# EAGLE schematic Botball_v7 (EAGLE 9.5.2), part 2 of 3
## Sheet 25 of 45
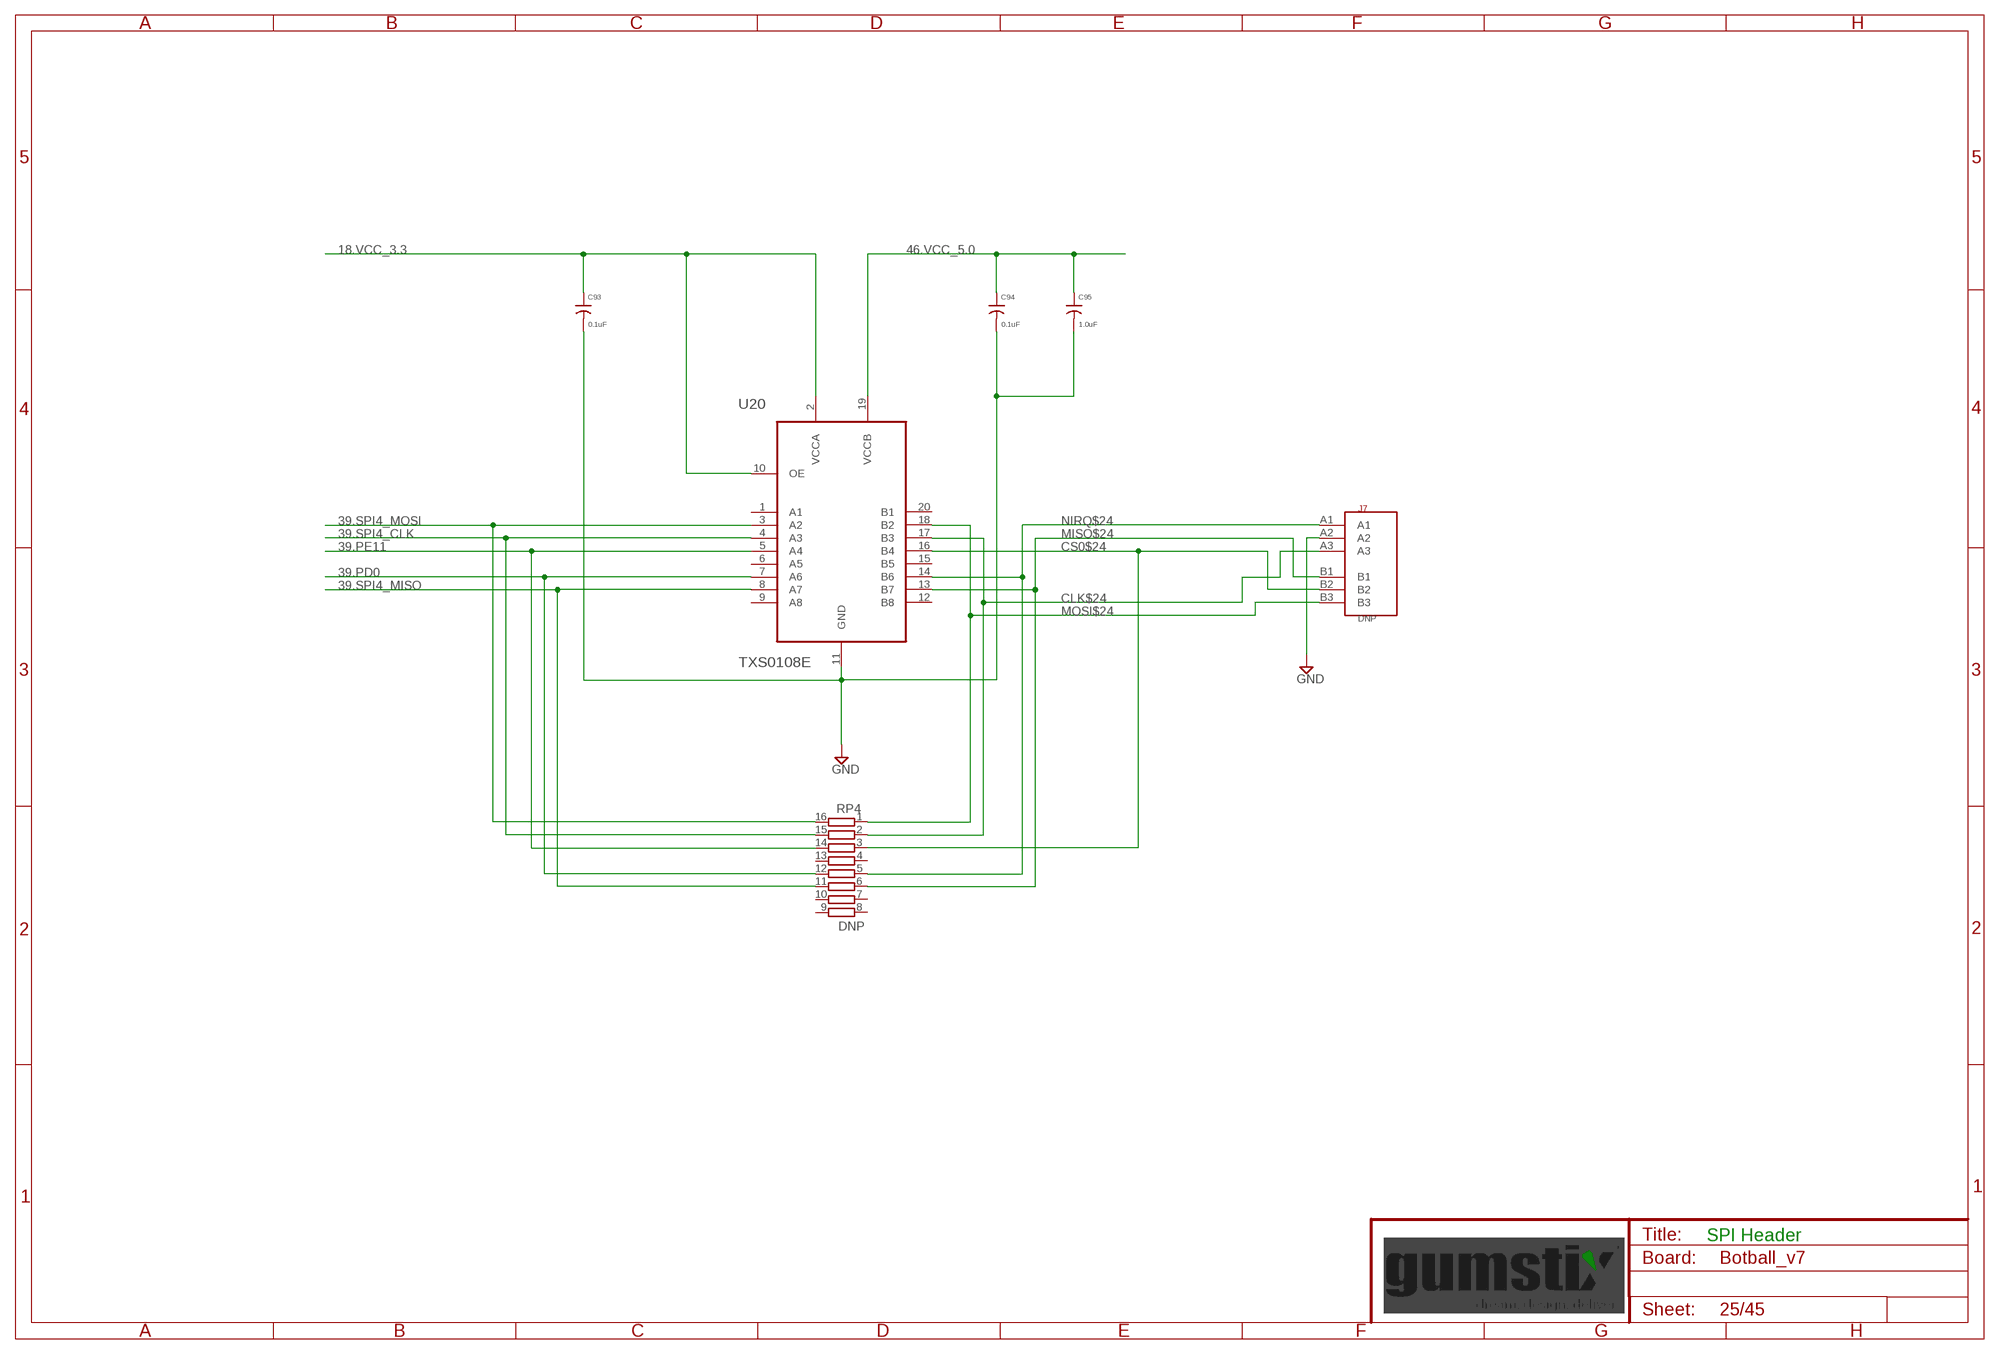
[diagram p24: schematic, sheet 25]

### Parts
C93  0.1uF  C0201  [0201]
C94  0.1uF  C0201  [0201]
C95  1.0uF  C0402  [0402]
J7  DNP  2X03  [2X03]
RP4  DNP  RP741X163  [741X16]
U20  TXS0108E  [QFN20]

### Nets
18.VCC_3.3 [supply]: C93.1 U20.2(VCCA) U20.10(OE) ; also sheet 3,4,7,8,9,11,12,13,14,16,17,18,19,20,21,23,24,26,27,28,29,31,33,34,36,37,38,39
39.PD0: RP4.12 U20.7(A6) ; also sheet 36
39.PE11: RP4.14 U20.5(A4) ; also sheet 36
39.SPI4_CLK: RP4.15 U20.4(A3) ; also sheet 36
39.SPI4_MISO: RP4.11 U20.8(A7) ; also sheet 36
39.SPI4_MOSI: RP4.16 U20.3(A2) ; also sheet 36
46.VCC_5.0 [supply]: C94.1 C95.1 U20.19(VCCB) ; also sheet 2,10,13,15,27,32,39,40,43,45
CLK$24: J7.A3 RP4.2 U20.17(B3)
CS0$24: J7.B2 RP4.3 U20.16(B4)
GND [supply]: C93.2 C94.2 C95.2 J7.A2 U20.11(GND) ; also sheet 2,3,4,5,6,7,9,10,11,12,13,14,15,16,17,18,19,20,21,22,23,24,26,27,28,29,30,31,32,33,34,35,36,37,38,39,40,41,42,43,44,45
MISO$24: J7.B1 RP4.6 U20.13(B7)
MOSI$24: J7.B3 RP4.1 U20.18(B2)
NIRQ$24: J7.A1 RP4.5 U20.14(B6)
Unconnected: RP4.4 RP4.7 RP4.8 RP4.9 RP4.10 RP4.13 U20.1(A1) U20.6(A5) U20.9(A8) U20.12(B8) U20.15(B5) U20.20(B1)

### Notes on the sheet
- SPI Header

## Sheet 26 of 45
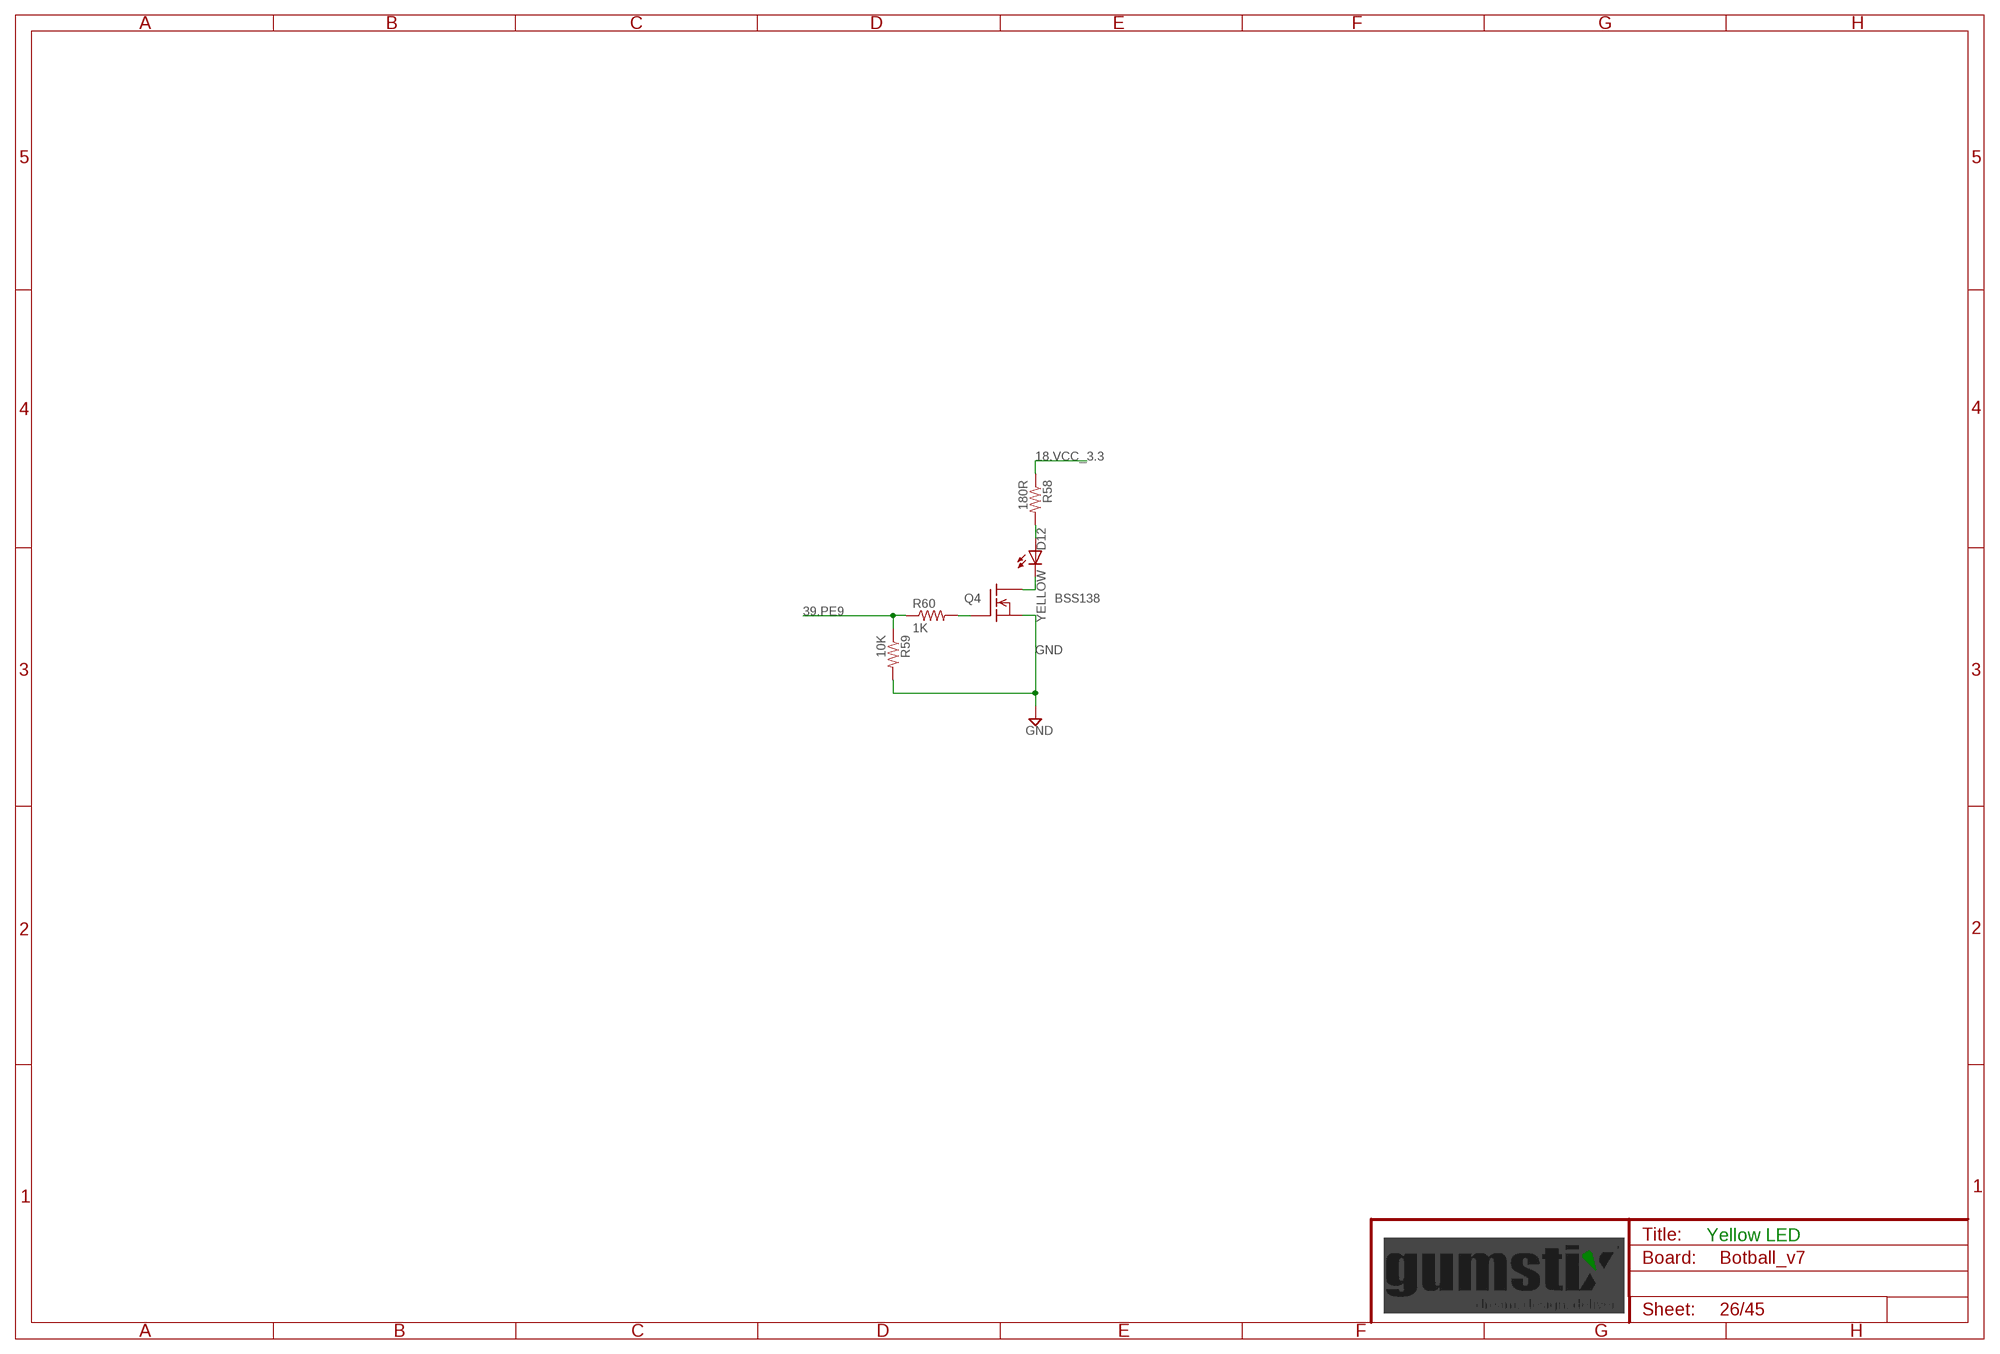
[diagram p25: schematic, sheet 26]

### Parts
D12  YELLOW  LED0603  [D0603]
Q4  BSS138  [SOT23]
R58  180R  R0402  [0402]
R59  10K  R0402  [0402]
R60  1K  R0402  [0402]

### Nets
18.VCC_3.3 [supply]: R58.1 ; also sheet 3,4,7,8,9,11,12,13,14,16,17,18,19,20,21,23,24,25,27,28,29,31,33,34,36,37,38,39
39.PE9: R59.1 R60.1 ; also sheet 36
GND [supply]: Q4.2(S) R59.2 ; also sheet 2,3,4,5,6,7,9,10,11,12,13,14,15,16,17,18,19,20,21,22,23,24,25,27,28,29,30,31,32,33,34,35,36,37,38,39,40,41,42,43,44,45
N1$26: D12.A R58.2
N2$26: D12.C Q4.3(D)
N3$26: Q4.1(G) R60.2

### Notes on the sheet
- Yellow LED

## Sheet 27 of 45
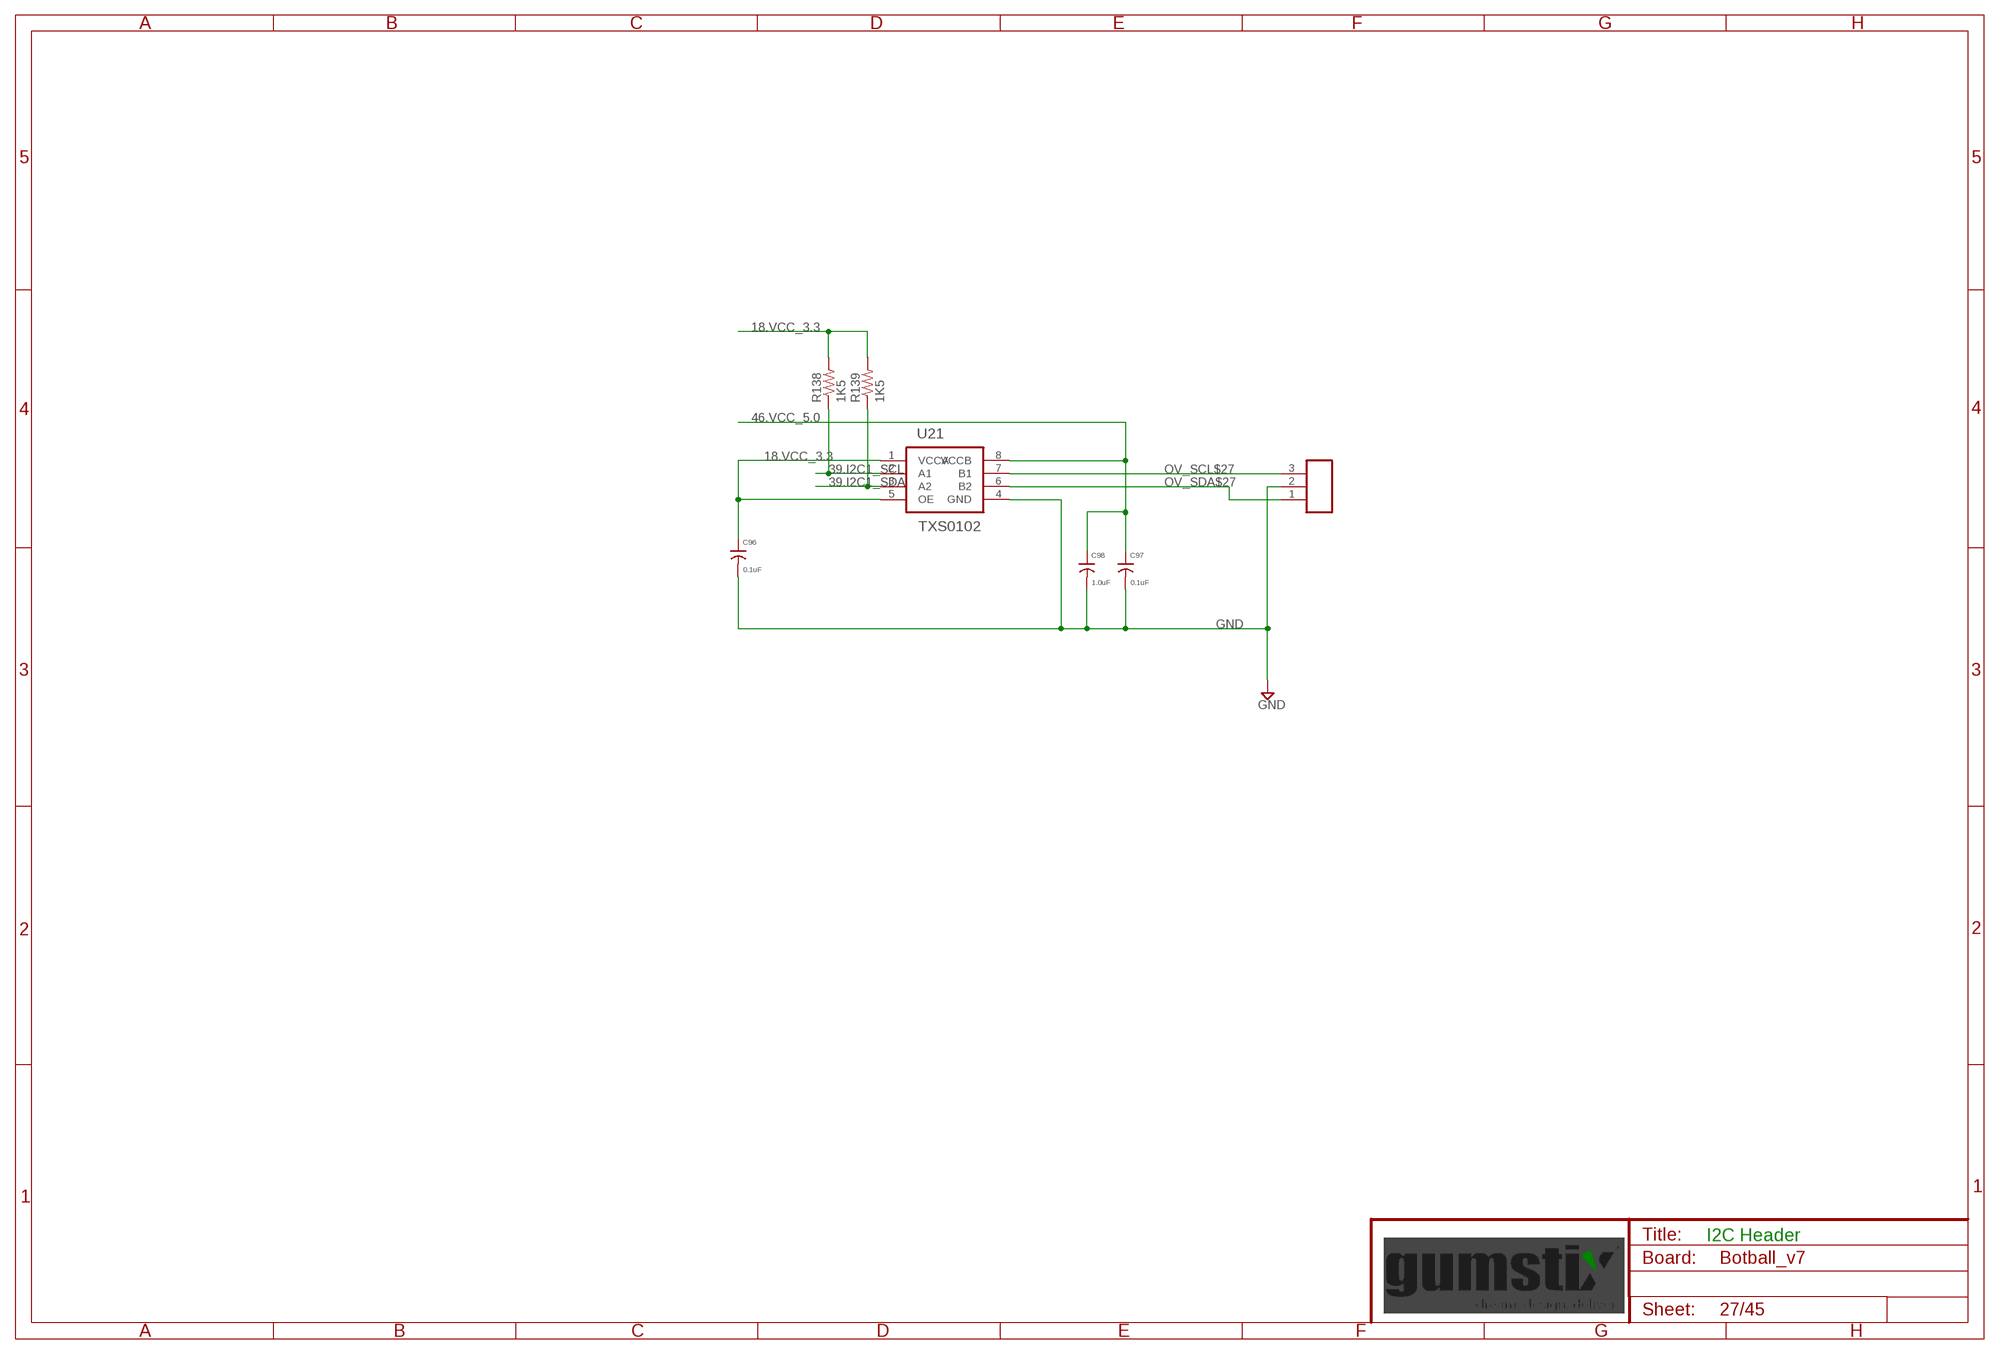
[diagram p26: schematic, sheet 27]

### Parts
C96  0.1uF  C0201  [0201]
C97  0.1uF  C0201  [0201]
C98  1.0uF  C0402  [0402]
J8  DNP  MA03X1100  [MA03-100]
R138  1K5  R0201  [0201]
R139  1K5  R0201  [0201]
U21  TXS0102  [DFN8-0.4P]

### Nets
18.VCC_3.3 [supply]: C96.1 R138.2 R139.2 U21.1(VCCA) U21.5(OE) ; also sheet 3,4,7,8,9,11,12,13,14,16,17,18,19,20,21,23,24,25,26,28,29,31,33,34,36,37,38,39
39.I2C1_SCL: R138.1 U21.2(A1) ; also sheet 36
39.I2C1_SDA: R139.1 U21.3(A2) ; also sheet 36
46.VCC_5.0 [supply]: C97.1 C98.1 U21.8(VCCB) ; also sheet 2,10,13,15,25,32,39,40,43,45
GND [supply]: C96.2 C97.2 C98.2 J8.2 U21.4(GND) ; also sheet 2,3,4,5,6,7,9,10,11,12,13,14,15,16,17,18,19,20,21,22,23,24,25,26,28,29,30,31,32,33,34,35,36,37,38,39,40,41,42,43,44,45
OV_SCL$27: J8.3 U21.7(B1)
OV_SDA$27: J8.1 U21.6(B2)

### Notes on the sheet
- I2C Header

## Sheet 28 of 45
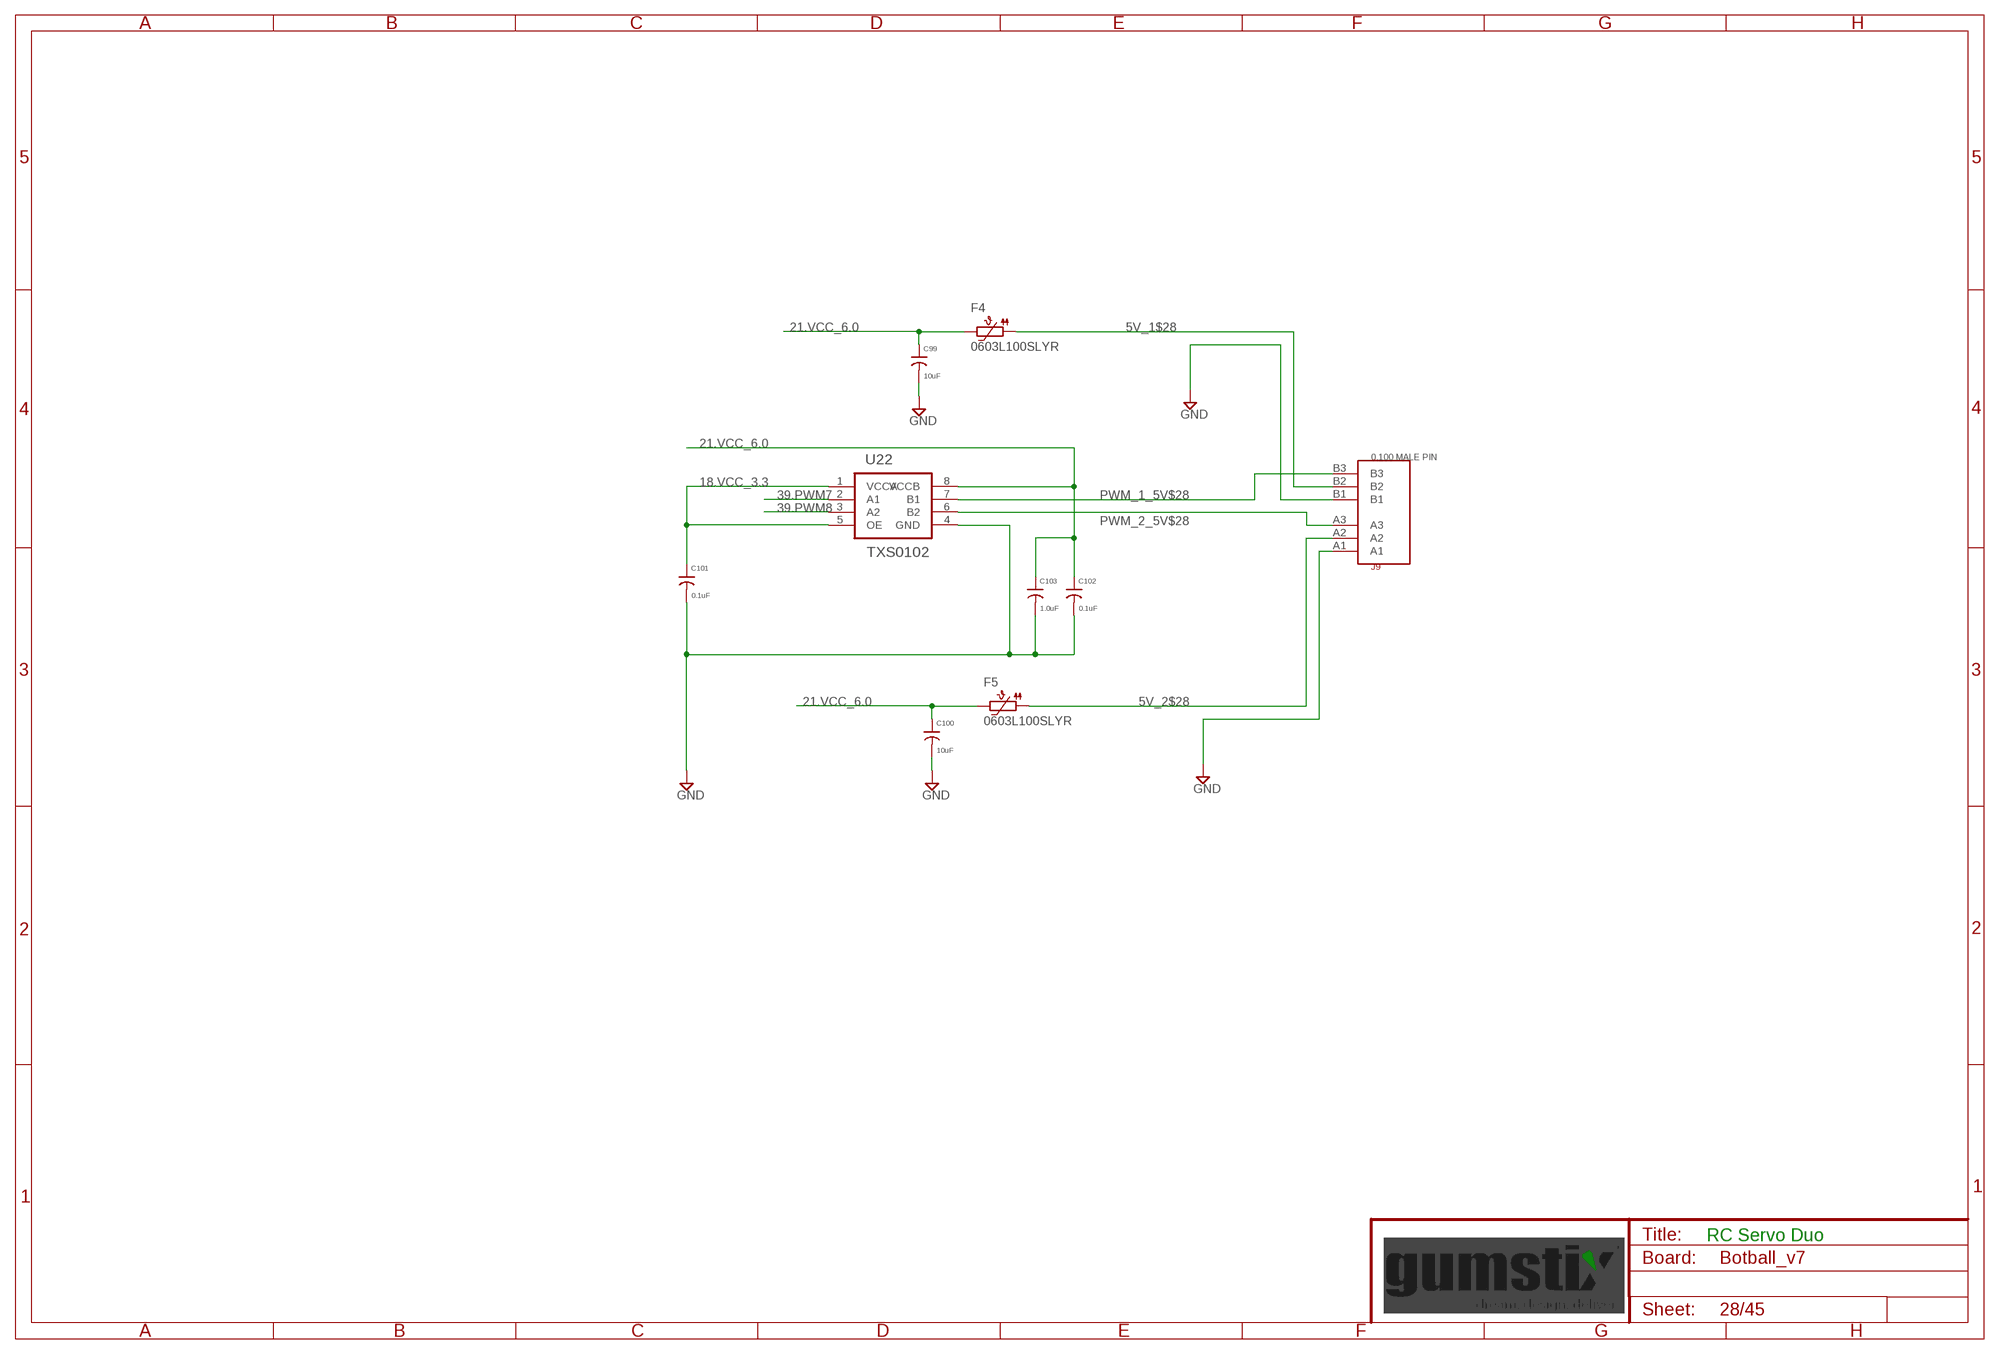
[diagram p27: schematic, sheet 28]

### Parts
C99  10uF  C0402  [0402]
C100  10uF  C0402  [0402]
C101  0.1uF  C0201  [0201]
C102  0.1uF  C0201  [0201]
C103  1.0uF  C0402  [0402]
F4  0603L100SLYR  PTC0603  [0603]
F5  0603L100SLYR  PTC0603  [0603]
J9  0.100 MALE PIN  2X03SHROUD  [2X03_SHROUD]
U22  TXS0102  [DFN8-0.4P]

### Nets
5V_1$28 [supply]: F4.1 J9.B2
5V_2$28 [supply]: F5.1 J9.A2
18.VCC_3.3 [supply]: C101.1 U22.1(VCCA) U22.5(OE) ; also sheet 3,4,7,8,9,11,12,13,14,16,17,18,19,20,21,23,24,25,26,27,29,31,33,34,36,37,38,39
21.VCC_6.0 [supply]: C99.1 C100.1 C102.1 C103.1 F4.2 F5.2 U22.8(VCCB) ; also sheet 3,22
39.PWM7: U22.2(A1) ; also sheet 36
39.PWM8: U22.3(A2) ; also sheet 36
GND [supply]: C99.2 C100.2 C101.2 C102.2 C103.2 J9.A1 J9.B1 U22.4(GND) ; also sheet 2,3,4,5,6,7,9,10,11,12,13,14,15,16,17,18,19,20,21,22,23,24,25,26,27,29,30,31,32,33,34,35,36,37,38,39,40,41,42,43,44,45
PWM_1_5V$28: J9.B3 U22.7(B1)
PWM_2_5V$28: J9.A3 U22.6(B2)

### Notes on the sheet
- RC Servo Duo

## Sheet 29 of 45
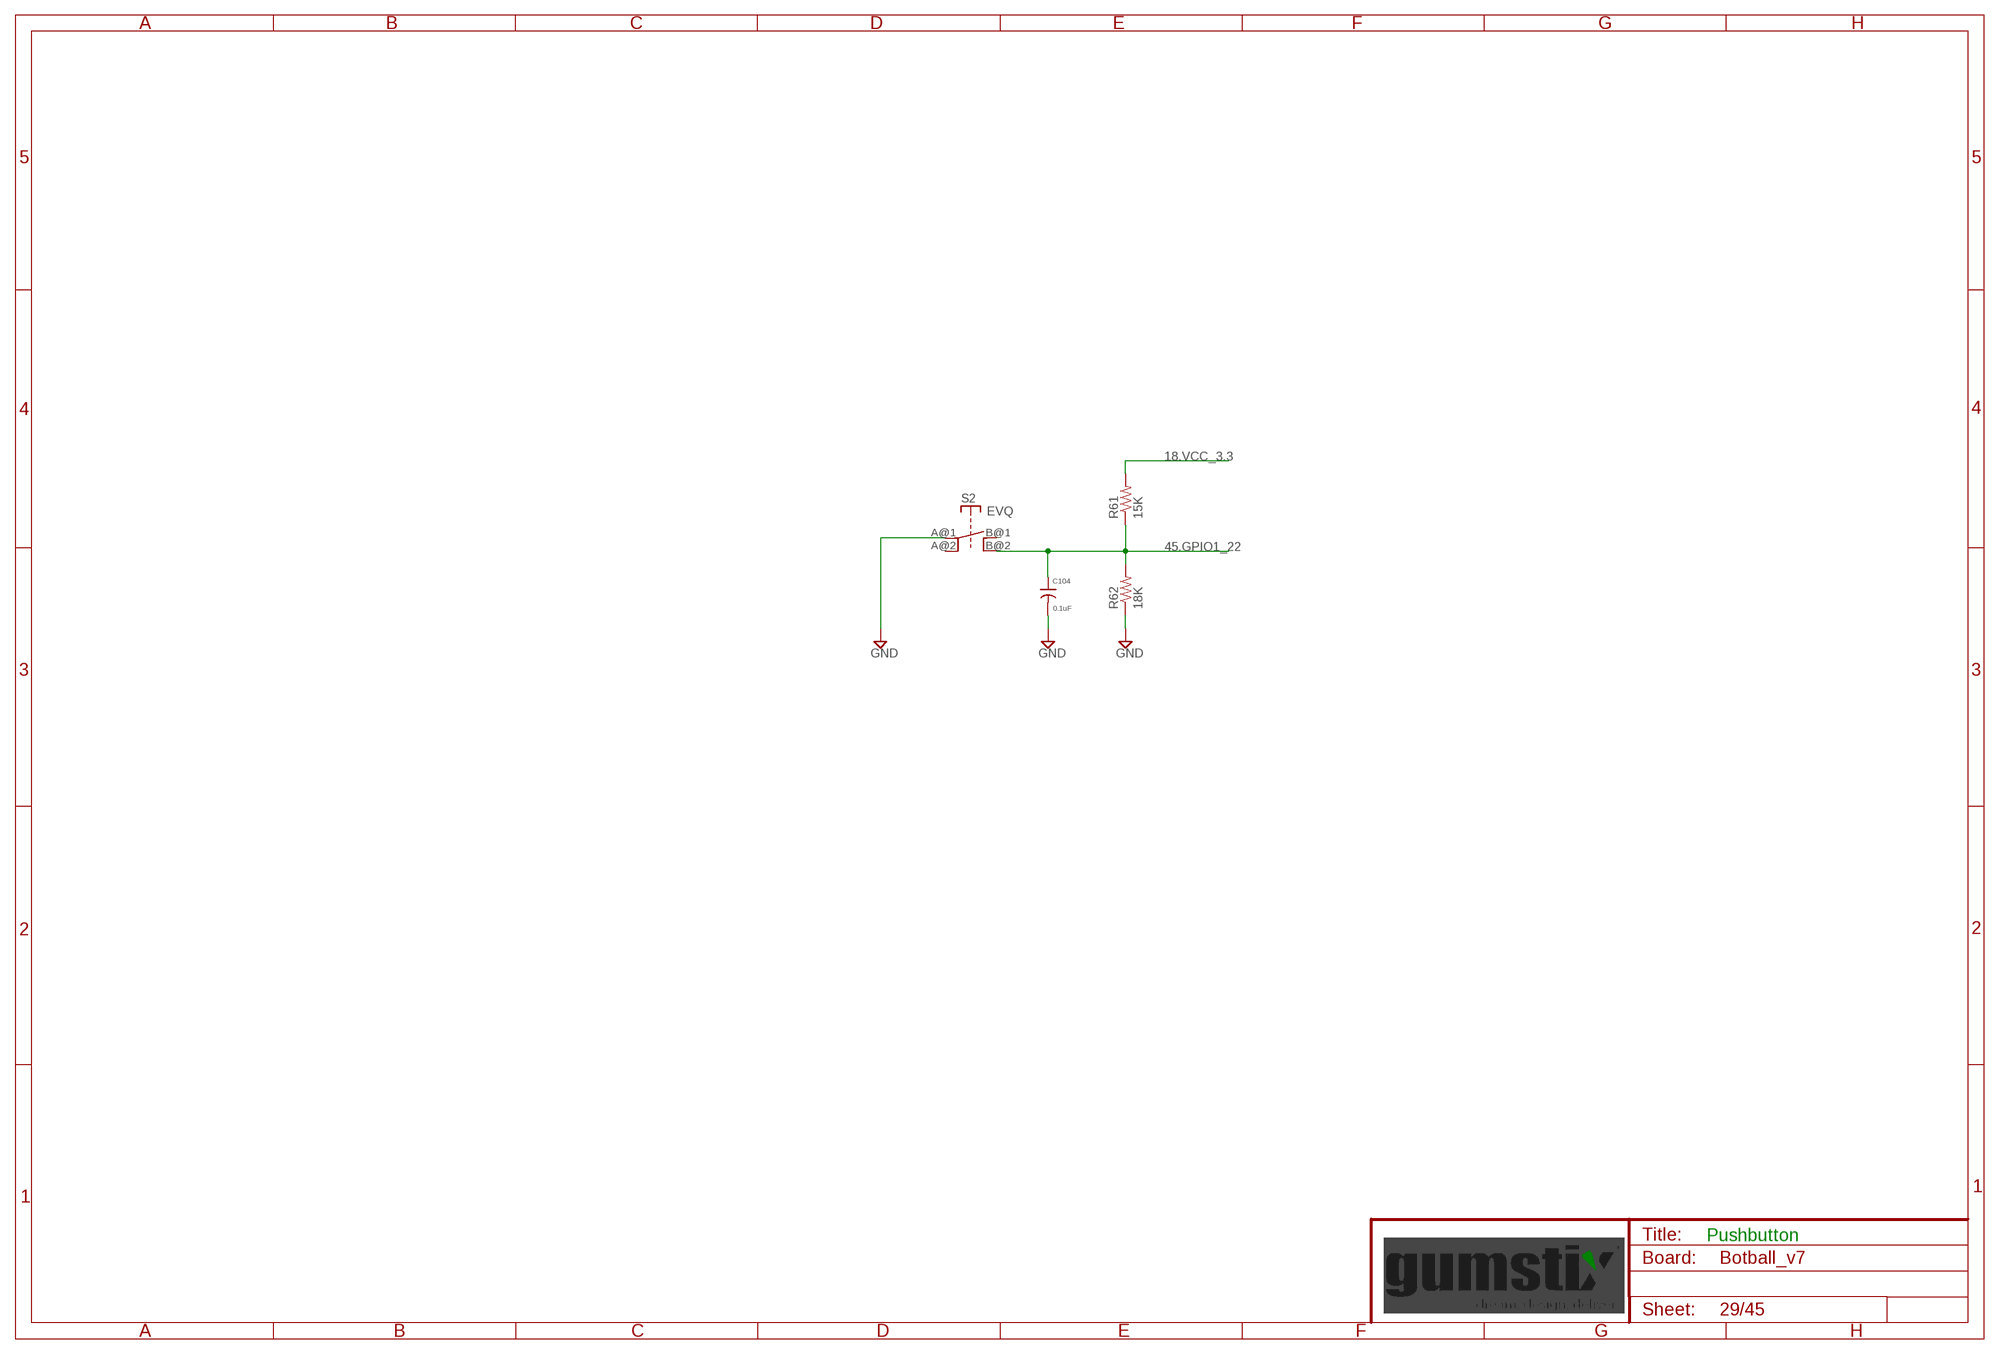
[diagram p28: schematic, sheet 29]

### Parts
C104  0.1uF  C0402  [0402]
R61  15K  R0402  [0402]
R62  18K  R0402  [0402]
S2  EVQ  [EVQ]

### Nets
18.VCC_3.3 [supply]: R61.2 ; also sheet 3,4,7,8,9,11,12,13,14,16,17,18,19,20,21,23,24,25,26,27,28,31,33,34,36,37,38,39
45.GPIO1_22: C104.1 R61.1 R62.2 S2.B@2(B') ; also sheet 42
GND [supply]: C104.2 R62.1 S2.A@1(A) ; also sheet 2,3,4,5,6,7,9,10,11,12,13,14,15,16,17,18,19,20,21,22,23,24,25,26,27,28,30,31,32,33,34,35,36,37,38,39,40,41,42,43,44,45
Unconnected: S2.A@2(A') S2.B@1(B)

### Notes on the sheet
- Pushbutton

## Sheet 30 of 45
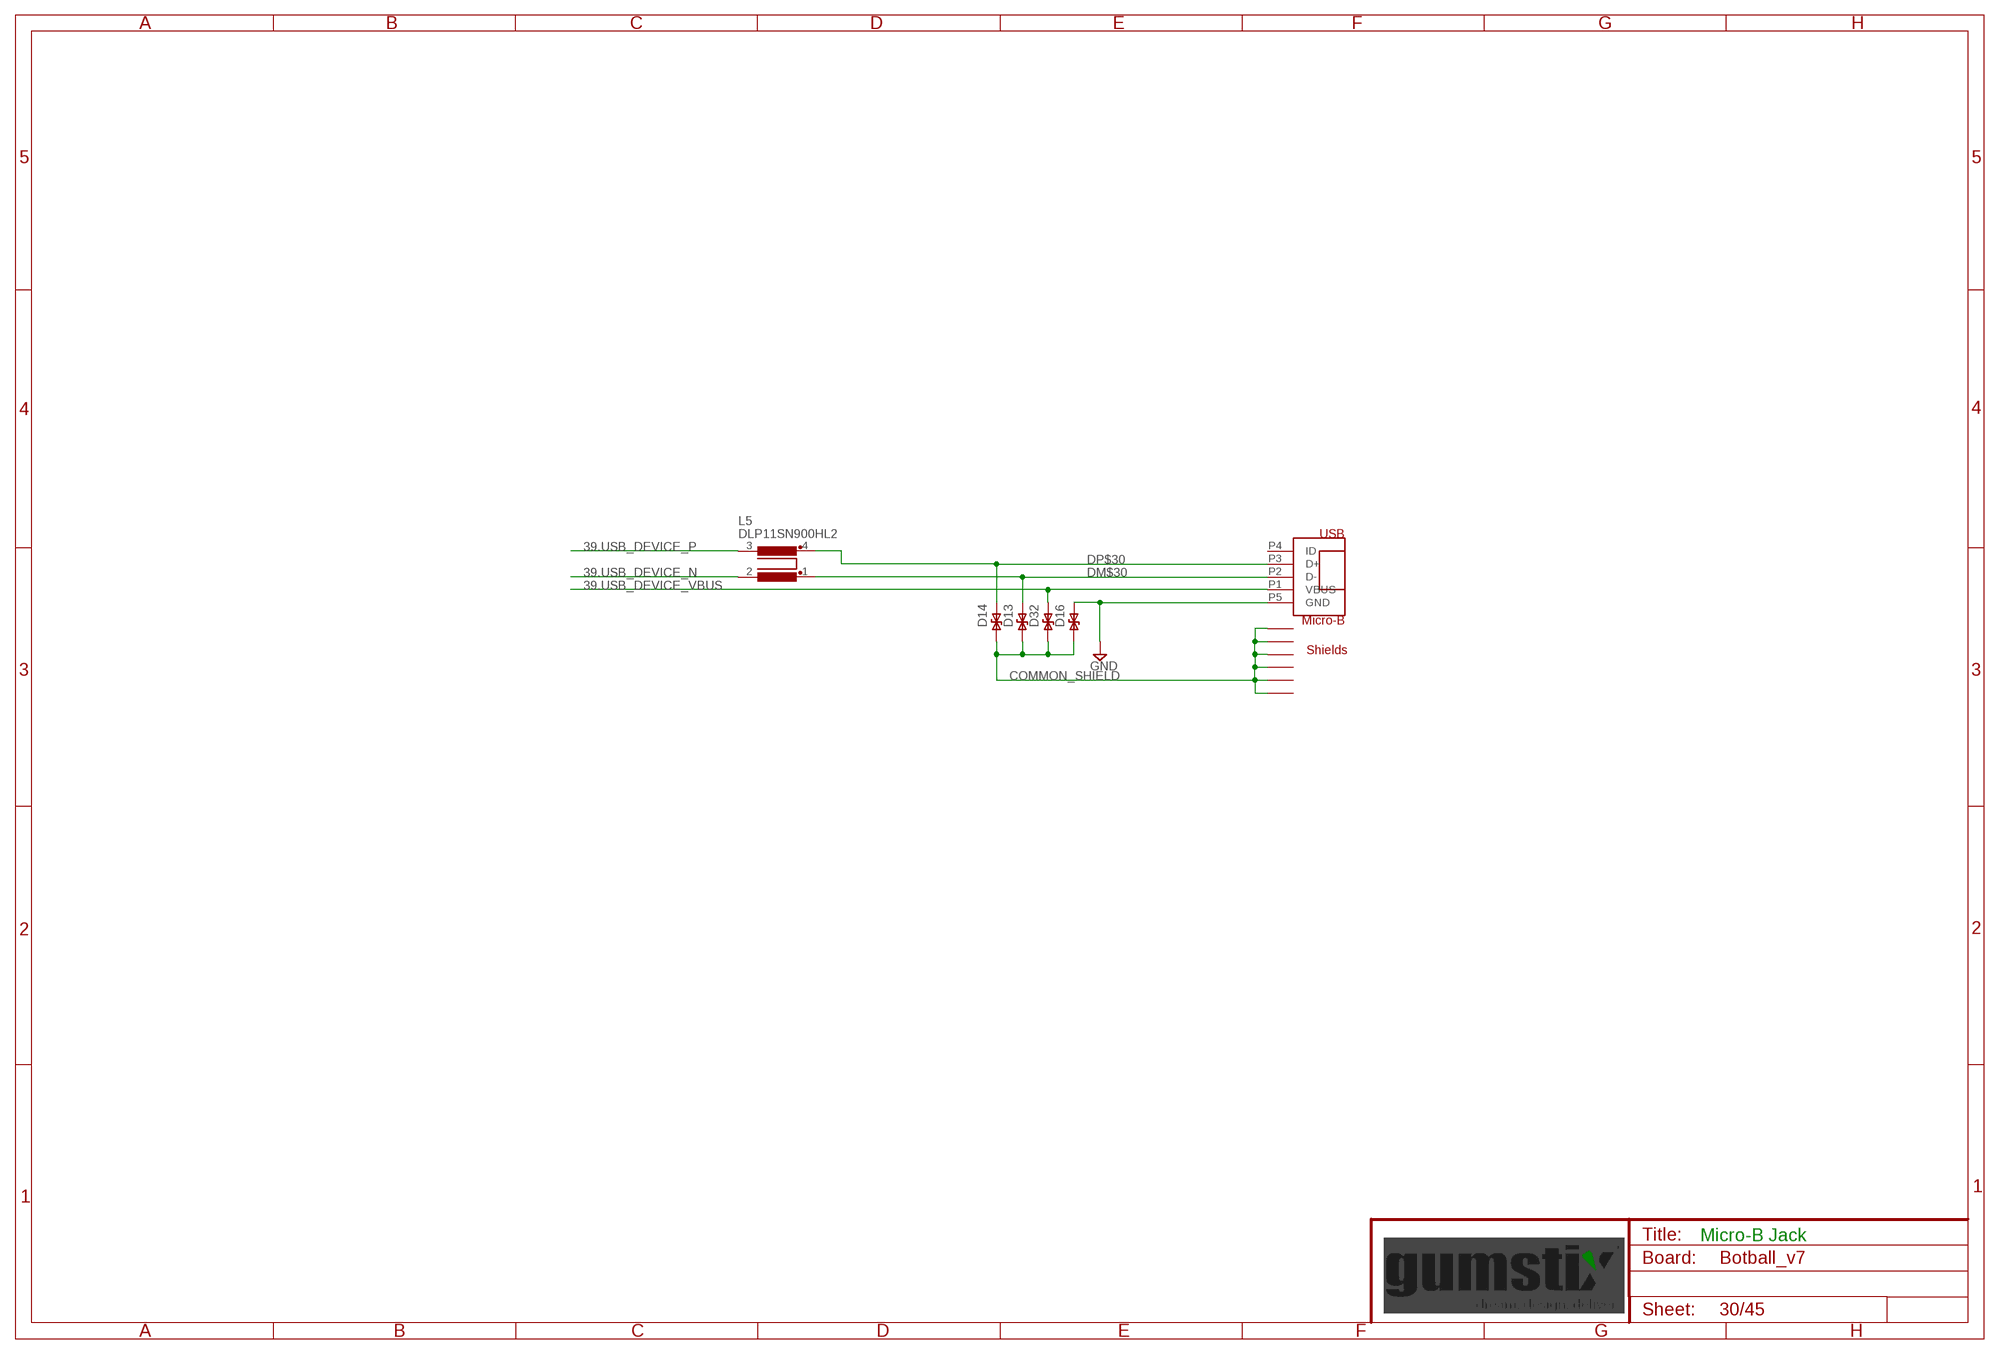
[diagram p29: schematic, sheet 30]

### Parts
D13  PS04LTVA1  ESD-DIODE  [D0402]
D14  PS04LTVA1  ESD-DIODE  [D0402]
D16  B72590D50A060  ESD-DIODE  [D0402]
D32  PS04LTVA1  ESD-DIODE  [D0402]
J10  USB_MICRO_B  [USB_MICRO_B]
L5  DLP11SN900HL2  COM_MODE_CHOKE  [0504-DLP11S]

### Nets
39.USB_DEVICE_N [USB]: L5.2 ; also sheet 36
39.USB_DEVICE_P [USB]: L5.3 ; also sheet 36
39.USB_DEVICE_VBUS [supply]: D32.P2 J10.P1(VBUS) ; also sheet 36
COMMON_SHIELD [supply]: D13.P1 D14.P1 D16.P1 D32.P1 J10.COMMON_SHEILD1(COMMON_SHIELD1) J10.COMMON_SHEILD2(COMMON_SHIELD2) J10.COMMON_SHEILD3(COMMON_SHIELD3) J10.COMMON_SHEILD4(COMMON_SHIELD4) J10.COMMON_SHEILD5(COMMON_SHIELD5) J10.COMMON_SHEILD6(COMMON_SHIELD6) ; also sheet 15,35,39
DM$30 [USB]: D13.P2 J10.P2(D-) L5.1
DP$30 [USB]: D14.P2 J10.P3(D+) L5.4
GND [supply]: D16.P2 J10.P5(GND) ; also sheet 2,3,4,5,6,7,9,10,11,12,13,14,15,16,17,18,19,20,21,22,23,24,25,26,27,28,29,31,32,33,34,35,36,37,38,39,40,41,42,43,44,45
Unconnected: J10.P4(ID)

### Notes on the sheet
- Micro-B Jack

## Sheet 31 of 45
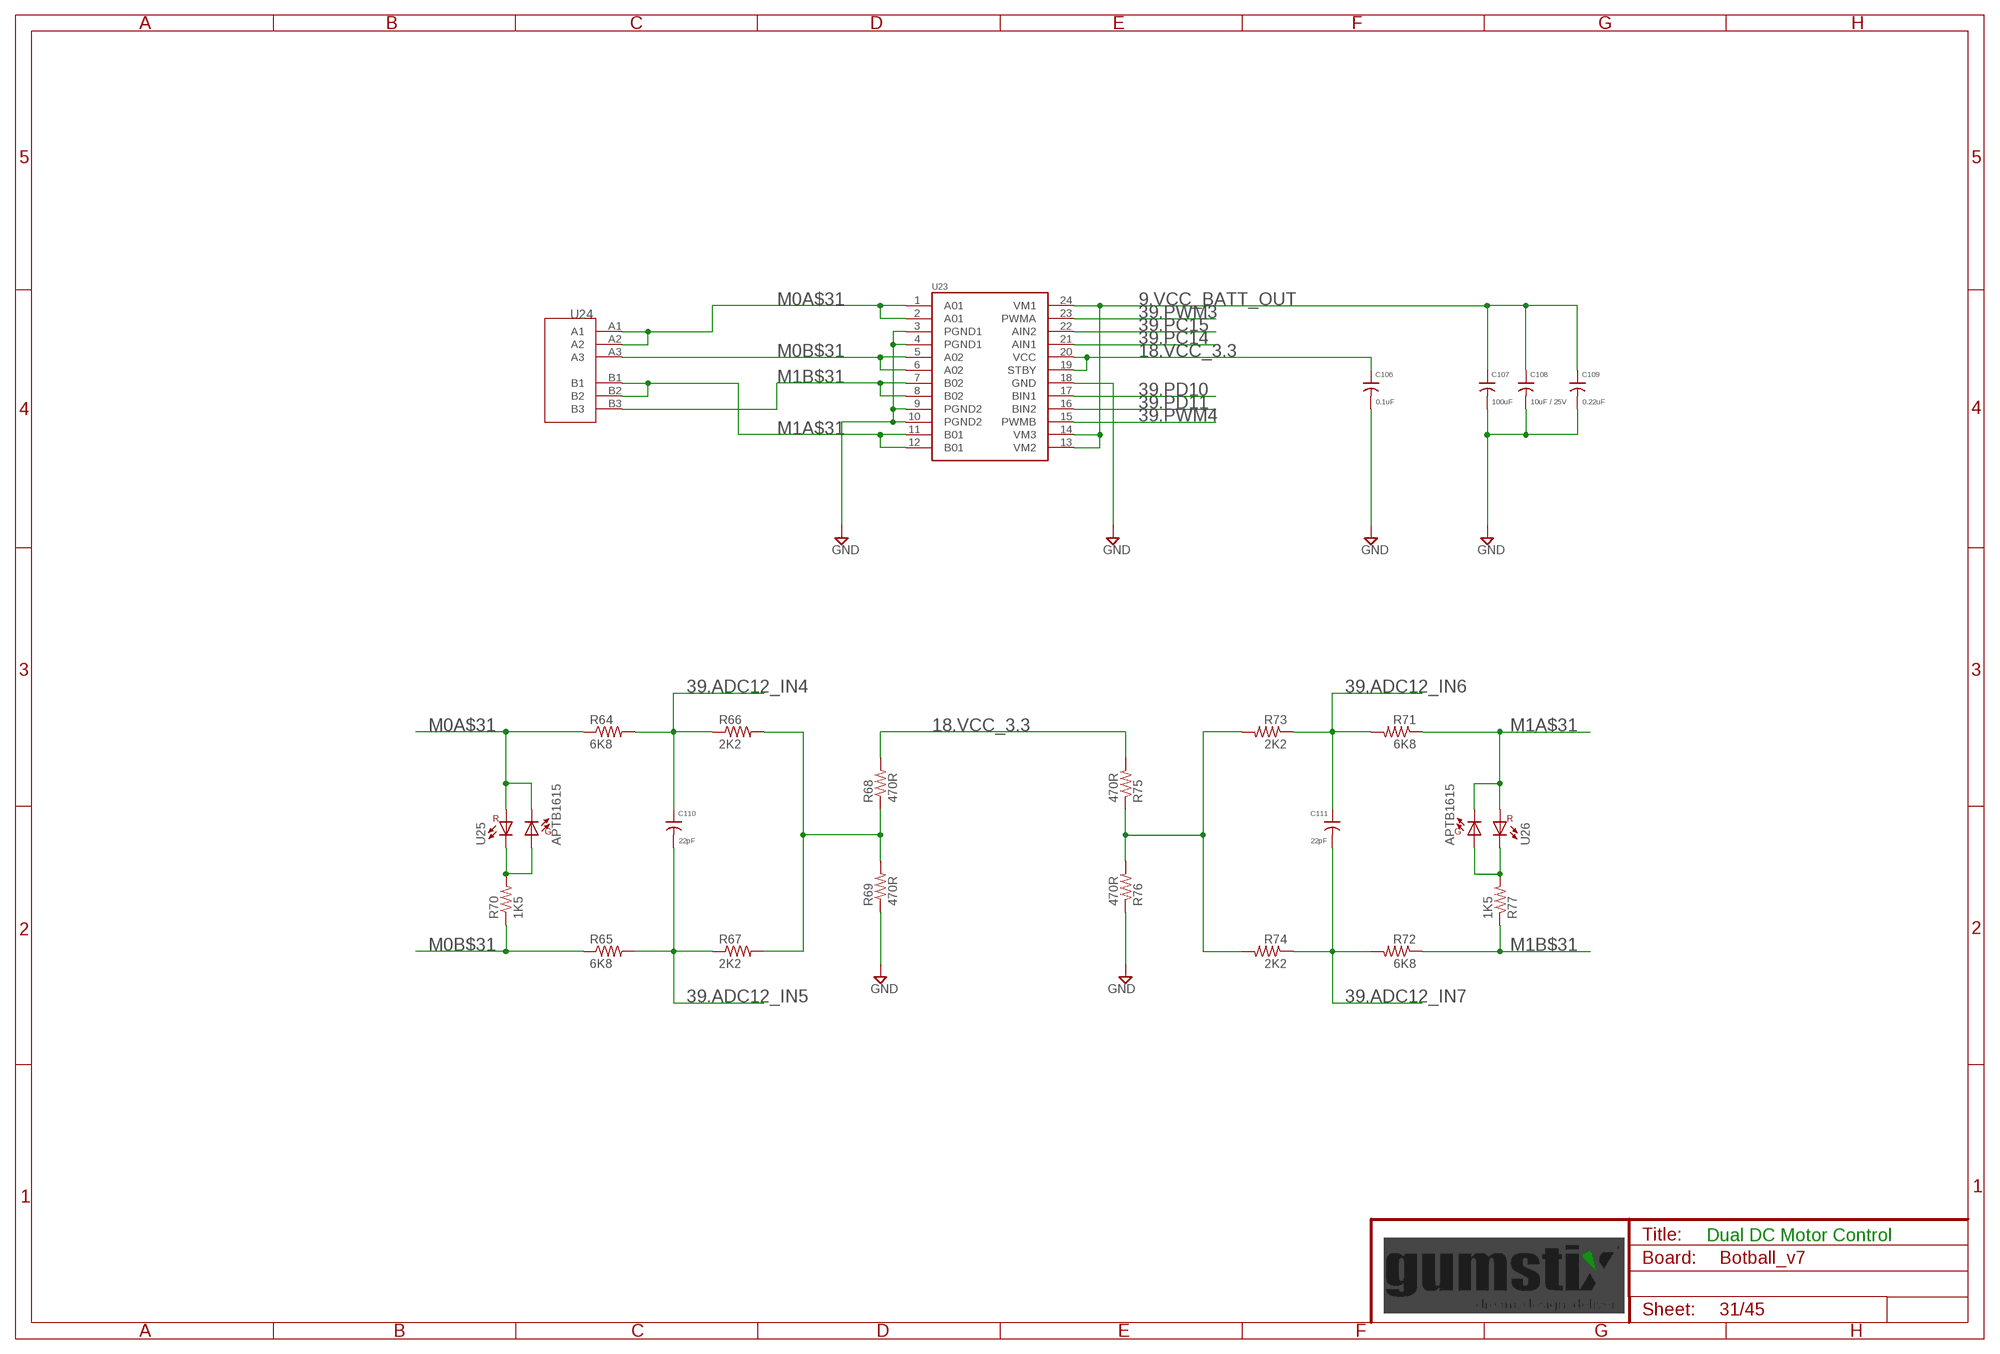
[diagram p30: schematic, sheet 31]

### Parts
C106  0.1uF  C0201  [0201]
C107  100uF  CPANASONIC_D  [PANASONIC_D]
C108  10uF / 25V  C1206  [1206]
C109  0.22uF  C0603  [0603]
C110  22pF  C0402  [0402]
C111  22pF  C0402  [0402]
R64  6K8  R0402  [0402]
R65  6K8  R0402  [0402]
R66  2K2  R0402  [0402]
R67  2K2  R0402  [0402]
R68  470R  R0402  [0402]
R69  470R  R0402  [0402]
R70  1K5  R0402  [0402]
R71  6K8  R0402  [0402]
R72  6K8  R0402  [0402]
R73  2K2  R0402  [0402]
R74  2K2  R0402  [0402]
R75  470R  R0402  [0402]
R76  470R  R0402  [0402]
R77  1K5  R0402  [0402]
U23  TB6612FNG  [SSOP24]
U24  MA03X2 FEMALE  MA03X2  [MA03-2]
U25  APTB1615  [APTB1615]
U26  APTB1615  [APTB1615]

### Nets
9.VCC_BATT_OUT [supply]: C107.+ C108.1 C109.1 U23.13(VM2) U23.14(VM3) U23.24(VM1) ; also sheet 7,10
18.VCC_3.3 [supply]: C106.1 R68.2 R75.2 U23.19(STBY) U23.20(VCC) ; also sheet 3,4,7,8,9,11,12,13,14,16,17,18,19,20,21,23,24,25,26,27,28,29,33,34,36,37,38,39
39.ADC12_IN4: C110.1 R64.2 R66.1 ; also sheet 36
39.ADC12_IN5: C110.2 R65.2 R67.1 ; also sheet 36
39.ADC12_IN6: C111.1 R71.2 R73.1 ; also sheet 36
39.ADC12_IN7: C111.2 R72.2 R74.1 ; also sheet 36
39.PC14: U23.21(AIN1) ; also sheet 36
39.PC15: U23.22(AIN2) ; also sheet 36
39.PD10: U23.17(BIN1) ; also sheet 36
39.PD11: U23.16(BIN2) ; also sheet 36
39.PWM3: U23.23(PWMA) ; also sheet 36
39.PWM4: U23.15(PWMB) ; also sheet 36
D0_OUT$31: R70.2 U25.2 U25.3
D1_OUT$31: R77.2 U26.2 U26.3
GND [supply]: C106.2 C107.- C108.2 C109.2 R69.1 R76.1 U23.3(PGND1) U23.4(PGND1) U23.9(PGND2) U23.10(PGND2) U23.18(GND) ; also sheet 2,3,4,5,6,7,9,10,11,12,13,14,15,16,17,18,19,20,21,22,23,24,25,26,27,28,29,30,32,33,34,35,36,37,38,39,40,41,42,43,44,45
M0A$31 [supply]: R64.1 U23.1(A01) U23.2(A01) U24.A1 U24.A2 U25.1 U25.4
M0B$31: R65.1 R70.1 U23.5(A02) U23.6(A02) U24.A3
M1A$31 [supply]: R71.1 U23.11(B01) U23.12(B01) U24.B1 U24.B2 U26.1 U26.4
M1B$31 [supply]: R72.1 R77.1 U23.7(B02) U23.8(B02) U24.B3
VD0$31: R66.2 R67.2 R68.1 R69.2
VD1$31: R73.2 R74.2 R75.1 R76.2

### Notes on the sheet
- Dual DC Motor Control

## Sheet 32 of 45
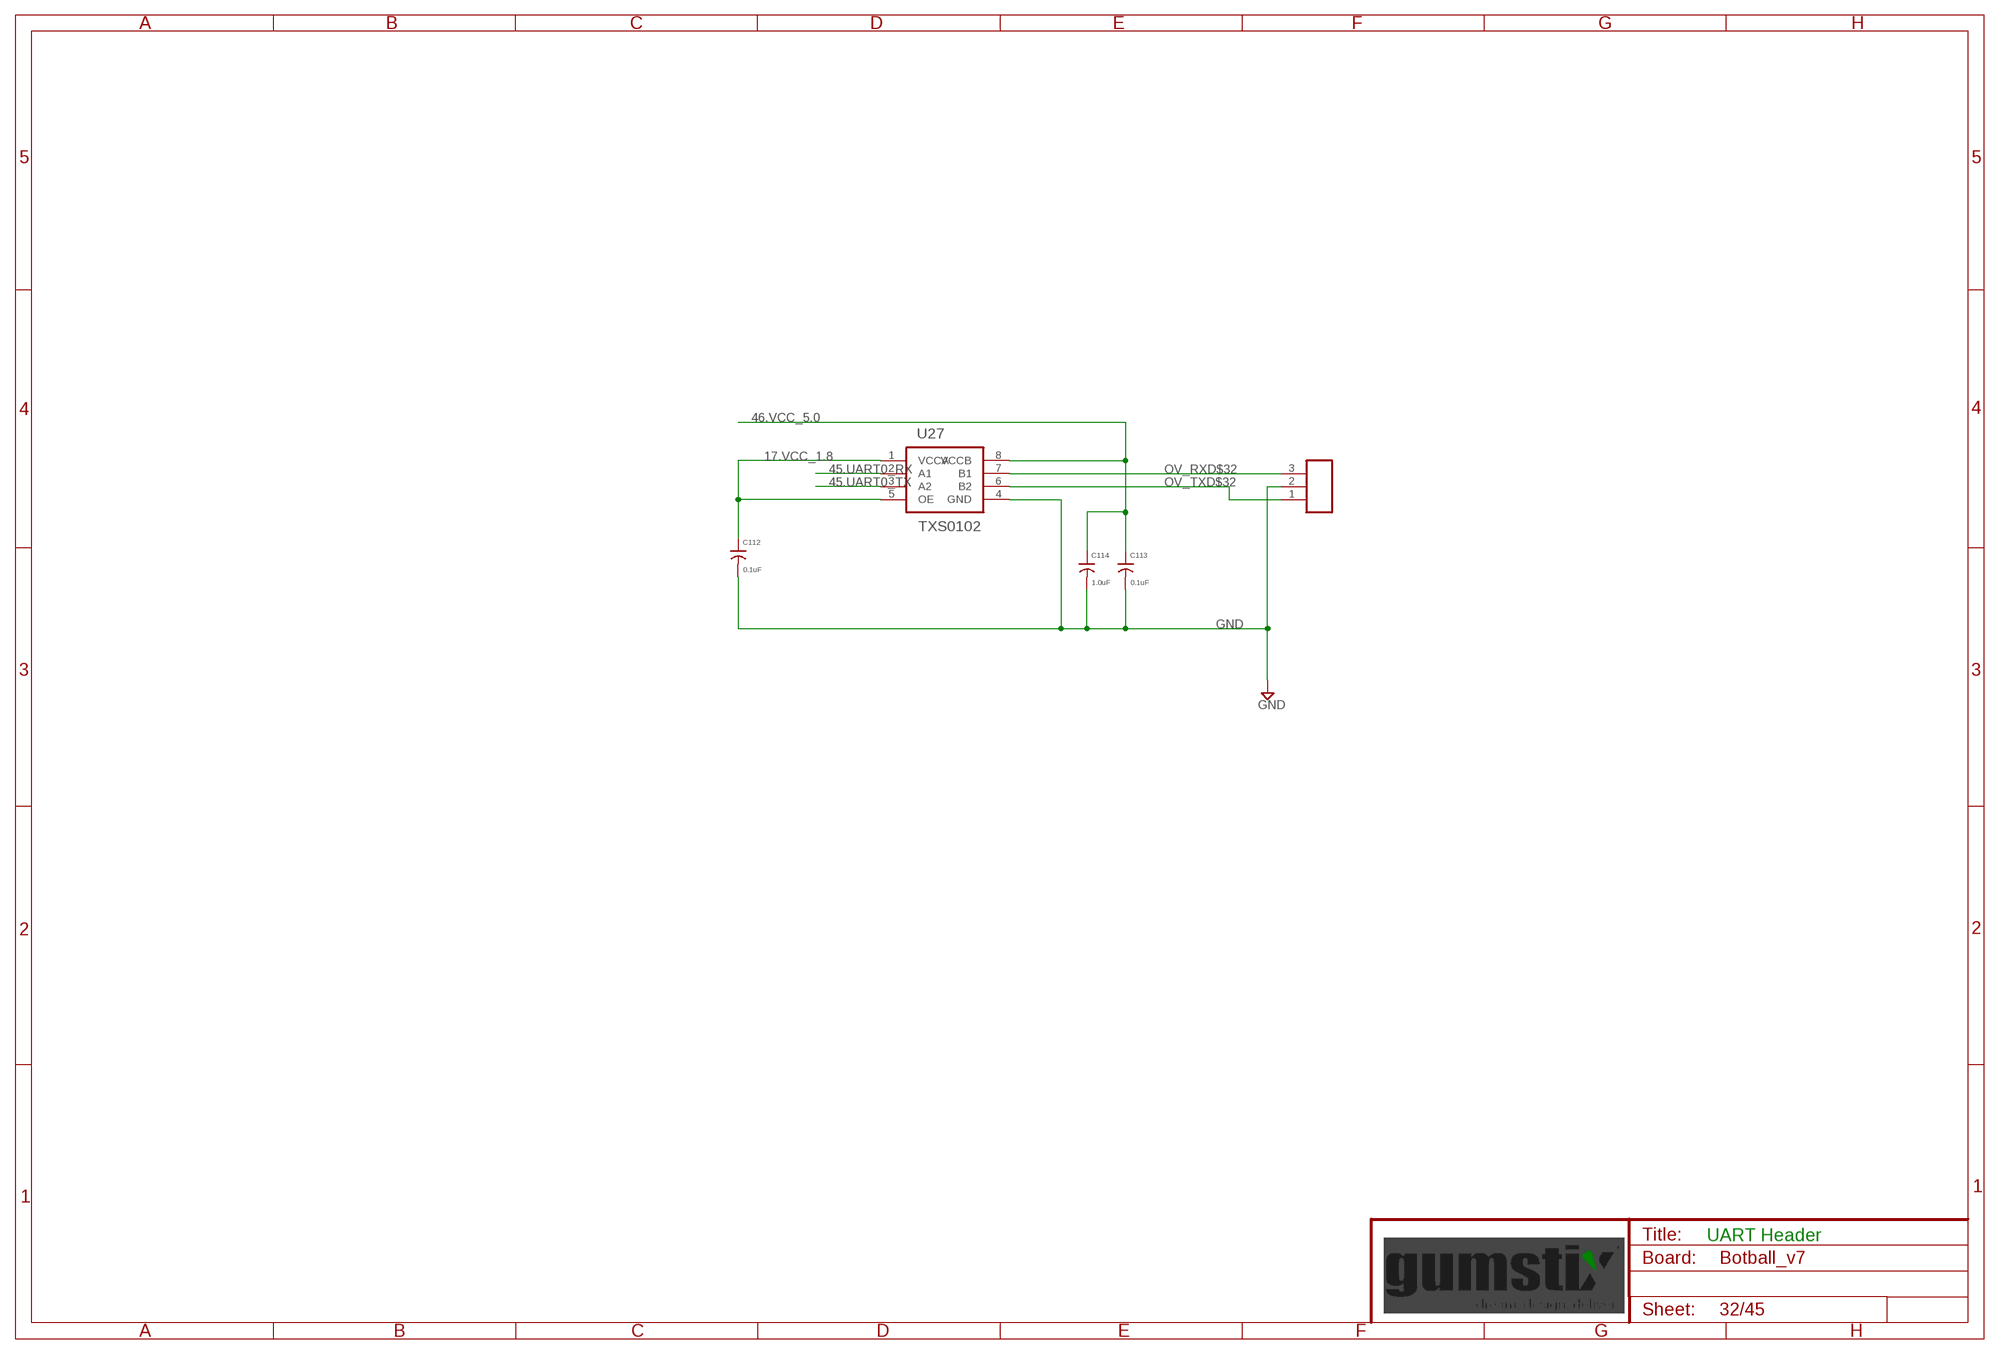
[diagram p31: schematic, sheet 32]

### Parts
C112  0.1uF  C0201  [0201]
C113  0.1uF  C0201  [0201]
C114  1.0uF  C0402  [0402]
J11  MA03X1 MALE  MA03X1100  [MA03-100]
U27  TXS0102  [DFN8-0.4P]

### Nets
17.VCC_1.8 [supply]: C112.1 U27.1(VCCA) U27.5(OE) ; also sheet 2,6,9,11,16,17,18,33,37,38,39
45.UART0_RX: U27.2(A1) ; also sheet 43
45.UART0_TX: U27.3(A2) ; also sheet 43
46.VCC_5.0 [supply]: C113.1 C114.1 U27.8(VCCB) ; also sheet 2,10,13,15,25,27,39,40,43,45
GND [supply]: C112.2 C113.2 C114.2 J11.2 U27.4(GND) ; also sheet 2,3,4,5,6,7,9,10,11,12,13,14,15,16,17,18,19,20,21,22,23,24,25,26,27,28,29,30,31,33,34,35,36,37,38,39,40,41,42,43,44,45
OV_RXD$32: J11.3 U27.7(B1)
OV_TXD$32: J11.1 U27.6(B2)

### Notes on the sheet
- UART Header

## Sheet 33 of 45
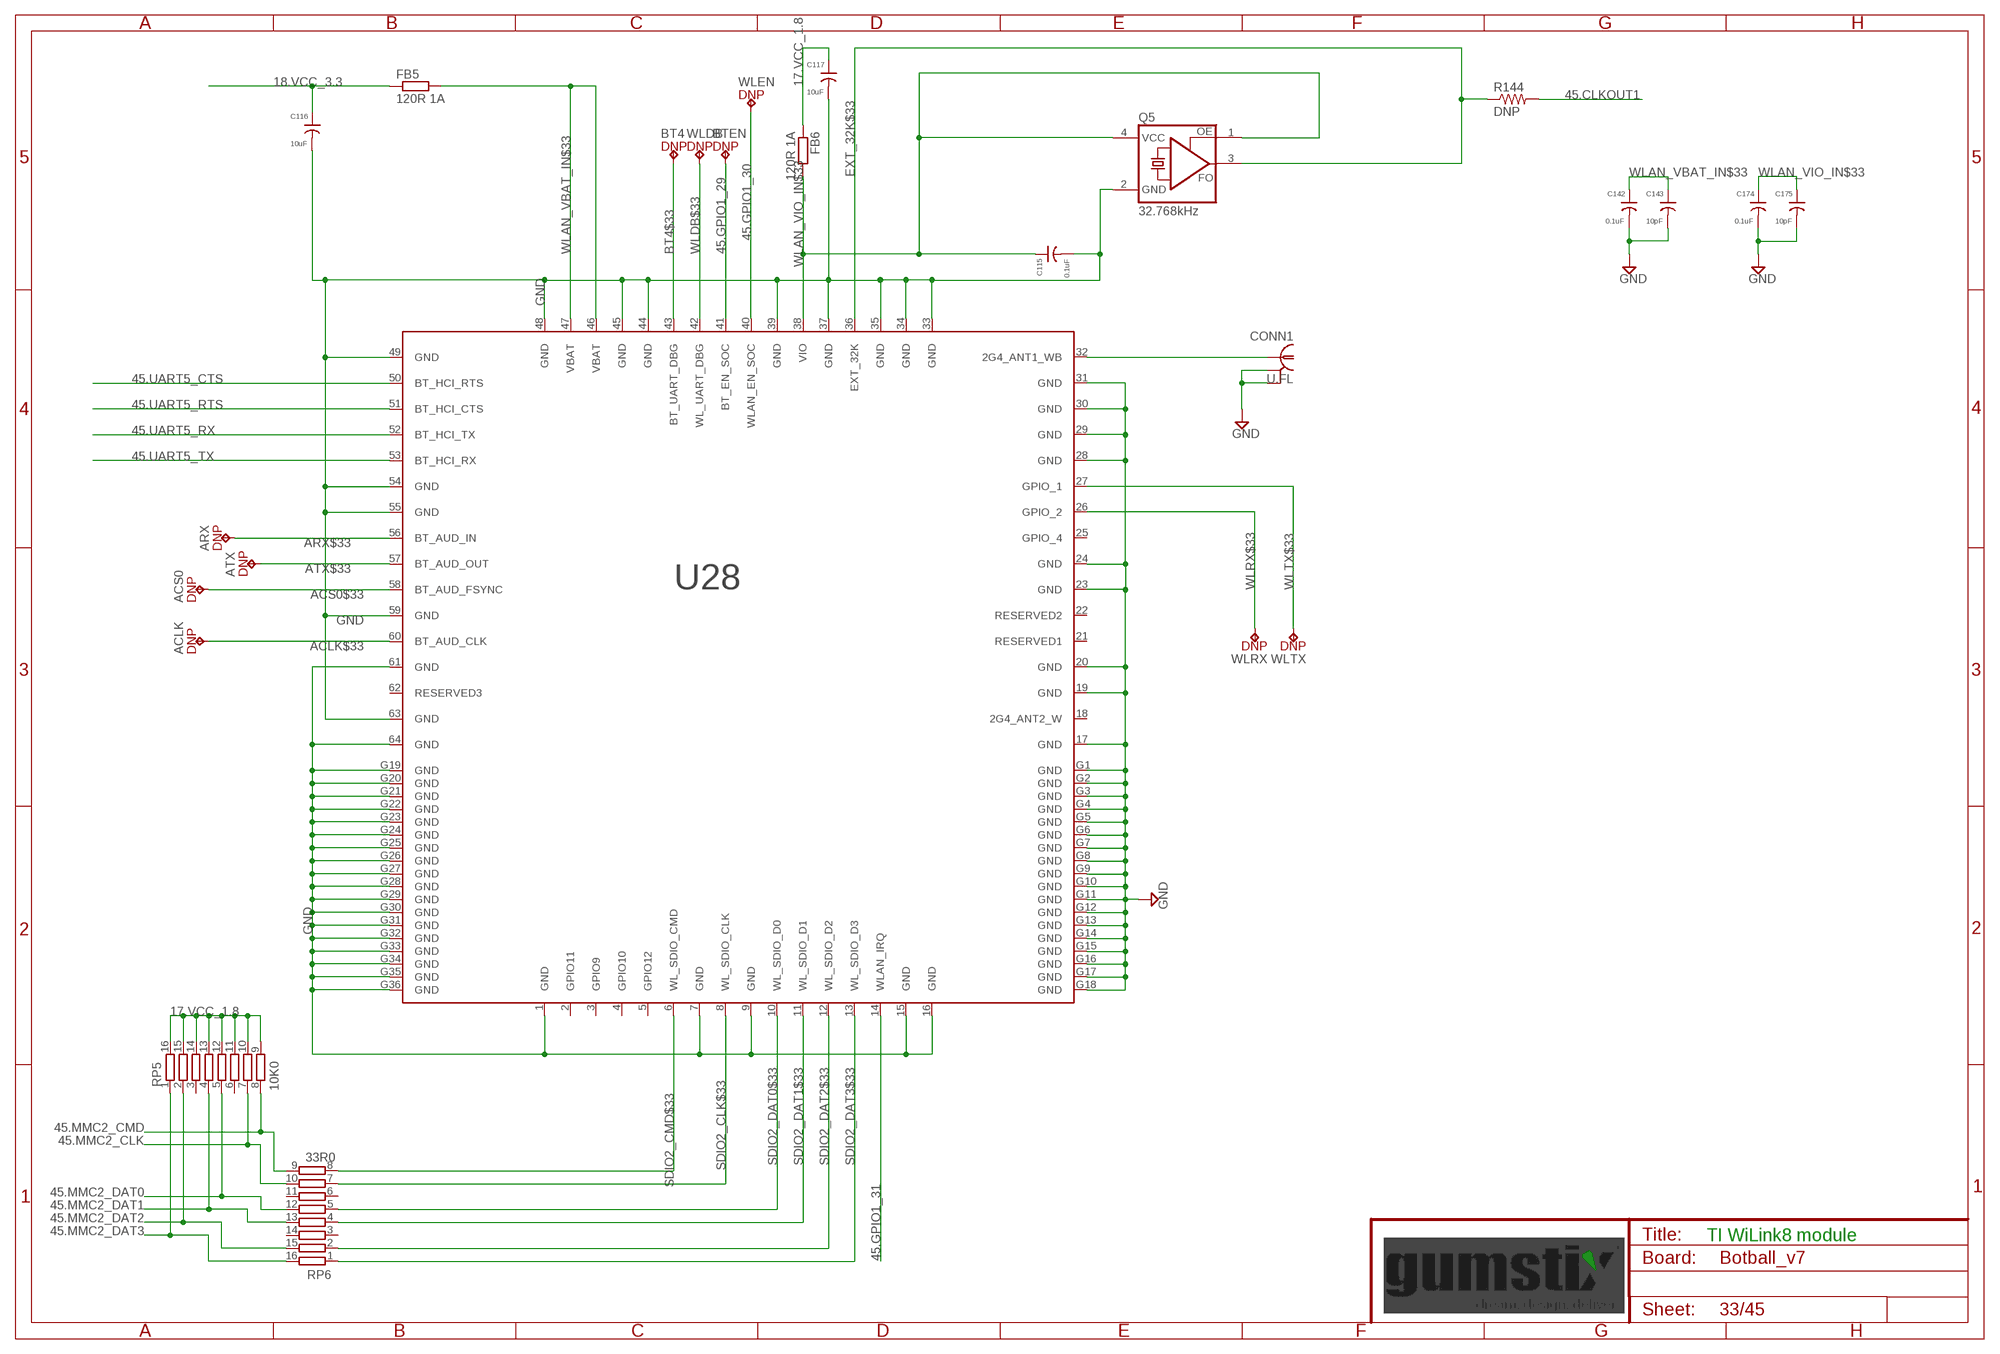
[diagram p32: schematic, sheet 33]

### Parts
ACLK  DNP  TP05  [TP0500]
ACS0  DNP  TP05  [TP0500]
ARX  DNP  TP05  [TP0500]
ATX  DNP  TP05  [TP0500]
BT4  DNP  TP05  [TP0500]
BTEN  DNP  TP05  [TP0500]
C115  0.1uF  C0402  [0402]
C116  10uF  C0603  [0603]
C117  10uF  C0603  [0603]
C142  0.1uF  C0402  [0402]
C143  10pF  C0402  [0402]
C174  0.1uF  C0402  [0402]
C175  10pF  C0402  [0402]
CONN1  U.FL  [U.FL]
FB5  120R 1A  FB0402  [0402]
FB6  120R 1A  FB0402  [0402]
Q5  32.768kHz  ASFL1  [ASF]
R144  DNP  R0402  [0402]
RP5  10K0  RP741X163  [741X16]
RP6  33R0  RP741X163  [741X16]
U28  WL1831MOD  WL1801MOD  [WL1801MOD]
WLDB  DNP  TP05  [TP0500]
WLEN  DNP  TP05  [TP0500]
WLRX  DNP  TP05  [TP0500]
WLTX  DNP  TP05  [TP0500]

### Nets
17.VCC_1.8 [supply]: C117.1 FB6.1 RP5.9 RP5.10 RP5.11 RP5.12 RP5.13 RP5.14 RP5.15 RP5.16 ; also sheet 2,6,9,11,16,17,18,32,37,38,39
18.VCC_3.3 [supply]: C116.1 FB5.1 ; also sheet 3,4,7,8,9,11,12,13,14,16,17,18,19,20,21,23,24,25,26,27,28,29,31,34,36,37,38,39
45.CLKOUT1: R144.2 ; also sheet 44
45.GPIO1_29: BTEN.1(TP) U28.41(BT_EN_SOC) ; also sheet 42
45.GPIO1_30: U28.40(WLAN_EN_SOC) WLEN.1(TP) ; also sheet 42
45.GPIO1_31: U28.14(WLAN_IRQ) ; also sheet 42
45.MMC2_CLK: RP5.7 RP6.10 ; also sheet 42
45.MMC2_CMD: RP5.8 RP6.9 ; also sheet 42
45.MMC2_DAT0: RP5.5 RP6.12 ; also sheet 42
45.MMC2_DAT1: RP5.4 RP6.13 ; also sheet 42
45.MMC2_DAT2: RP5.2 RP6.15 ; also sheet 42
45.MMC2_DAT3: RP5.1 RP6.16 ; also sheet 42
45.UART5_CTS: U28.50(BT_HCI_RTS) ; also sheet 43
45.UART5_RTS: U28.51(BT_HCI_CTS) ; also sheet 43
45.UART5_RX: U28.52(BT_HCI_TX) ; also sheet 43
45.UART5_TX: U28.53(BT_HCI_RX) ; also sheet 43
ACLK$33: ACLK.1(TP) U28.60(BT_AUD_CLK)
ACS0$33: ACS0.1(TP) U28.58(BT_AUD_FSYNC)
ANT$33: CONN1.1 U28.32(2G4_ANT1_WB)
ARX$33: ARX.1(TP) U28.56(BT_AUD_IN)
ATX$33: ATX.1(TP) U28.57(BT_AUD_OUT)
BT4$33: BT4.1(TP) U28.43(BT_UART_DBG)
EXT_32K$33: Q5.3(FO) R144.1 U28.36(EXT_32K)
GND [supply]: C115.2 C116.2 C117.2 C142.2 C143.2 C174.2 C175.2 CONN1.2 CONN1.3 Q5.2(GND) U28.1(GND) U28.7(GND) U28.9(GND) U28.15(GND) U28.16(GND) U28.17(GND) U28.19(GND) U28.20(GND) U28.23(GND) U28.24(GND) U28.28(GND) U28.29(GND) U28.30(GND) U28.31(GND) U28.33(GND) U28.34(GND) U28.35(GND) U28.37(GND) U28.39(GND) U28.44(GND) U28.45(GND) U28.48(GND) U28.49(GND) U28.54(GND) U28.55(GND) U28.59(GND) U28.61(GND) U28.63(GND) U28.64(GND) U28.G1(GND) U28.G2(GND) U28.G3(GND) U28.G4(GND) U28.G5(GND) U28.G6(GND) U28.G7(GND) U28.G8(GND) U28.G9(GND) U28.G10(GND) U28.G11(GND) U28.G12(GND) U28.G13(GND) U28.G14(GND) U28.G15(GND) U28.G16(GND) U28.G17(GND) U28.G18(GND) U28.G19(GND) U28.G20(GND) U28.G21(GND) U28.G22(GND) U28.G23(GND) U28.G24(GND) U28.G25(GND) U28.G26(GND) U28.G27(GND) U28.G28(GND) U28.G29(GND) U28.G30(GND) U28.G31(GND) U28.G32(GND) U28.G33(GND) U28.G34(GND) U28.G35(GND) U28.G36(GND) ; also sheet 2,3,4,5,6,7,9,10,11,12,13,14,15,16,17,18,19,20,21,22,23,24,25,26,27,28,29,30,31,32,34,35,36,37,38,39,40,41,42,43,44,45
SDIO2_CLK$33: RP6.7 U28.8(WL_SDIO_CLK)
SDIO2_CMD$33: RP6.8 U28.6(WL_SDIO_CMD)
SDIO2_DAT0$33: RP6.5 U28.10(WL_SDIO_D0)
SDIO2_DAT1$33: RP6.4 U28.11(WL_SDIO_D1)
SDIO2_DAT2$33: RP6.2 U28.12(WL_SDIO_D2)
SDIO2_DAT3$33: RP6.1 U28.13(WL_SDIO_D3)
WLAN_VBAT_IN$33 [supply]: C142.1 C143.1 FB5.2 U28.46(VBAT) U28.47(VBAT)
WLAN_VIO_IN$33 [supply]: C115.1 C174.1 C175.1 FB6.2 Q5.1(OE) Q5.4(VCC) U28.38(VIO)
WLDB$33: U28.42(WL_UART_DBG) WLDB.1(TP)
WLRX$33: U28.26(GPIO_2) WLRX.1(TP)
WLTX$33: U28.27(GPIO_1) WLTX.1(TP)
Unconnected: RP5.3 RP5.6 RP6.3 RP6.6 RP6.11 RP6.14 U28.2(GPIO11) U28.3(GPIO9) U28.4(GPIO10) U28.5(GPIO12) U28.18(2G4_ANT2_W) U28.21(RESERVED1) U28.22(RESERVED2) U28.25(GPIO_4) U28.62(RESERVED3)

### Notes on the sheet
- TI WiLink8 module

## Sheet 34 of 45
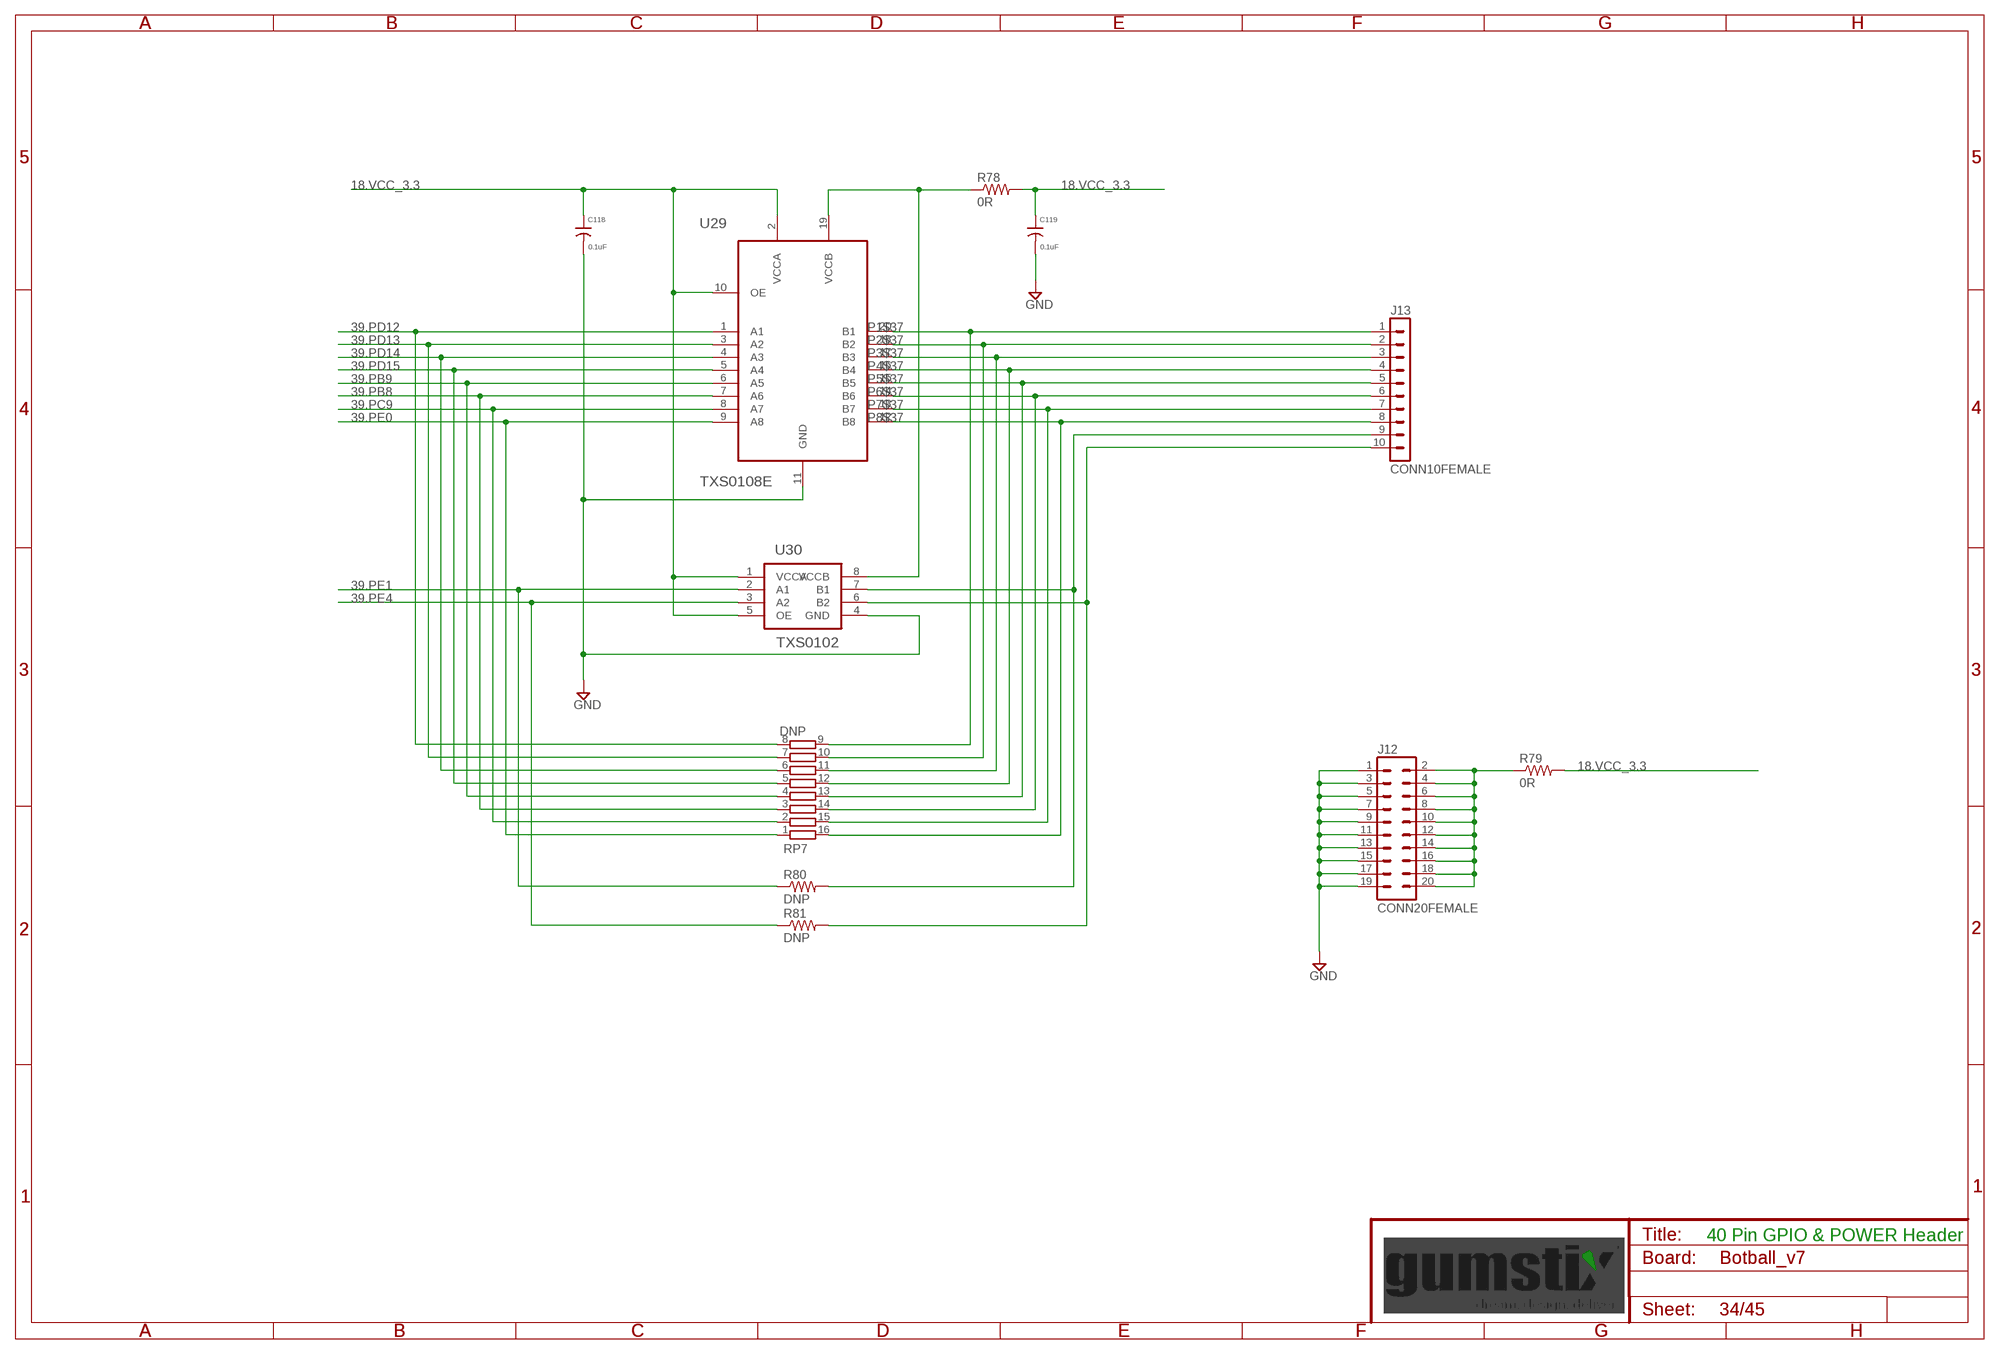
[diagram p33: schematic, sheet 34]

### Parts
C118  0.1uF  C0201  [0201]
C119  0.1uF  C0201  [0201]
J12  CONN20FEMALE  CONN20HEADER  [057-020-1]
J13  CONN10FEMALE  CONN10HEADER  [057-010-1]
R78  0R  R0201  [0201]
R79  0R  R0603  [0603]
R80  DNP  R0201  [0201]
R81  DNP  R0201  [0201]
RP7  DNP  RP741X163  [741X16]
U29  TXS0108E  [QFN20]
U30  TXS0102  [DFN8-0.4P]

### Nets
18.VCC_3.3 [supply]: C118.1 C119.1 R78.2 R79.2 U29.2(VCCA) U29.10(OE) U30.1(VCCA) U30.5(OE) ; also sheet 3,4,7,8,9,11,12,13,14,16,17,18,19,20,21,23,24,25,26,27,28,29,31,33,36,37,38,39
39.PB8: RP7.3 U29.7(A6) ; also sheet 36
39.PB9: RP7.4 U29.6(A5) ; also sheet 36
39.PC9: RP7.2 U29.8(A7) ; also sheet 36
39.PD12: RP7.8 U29.1(A1) ; also sheet 36
39.PD13: RP7.7 U29.3(A2) ; also sheet 36
39.PD14: RP7.6 U29.4(A3) ; also sheet 36
39.PD15: RP7.5 U29.5(A4) ; also sheet 36
39.PE0: RP7.1 U29.9(A8) ; also sheet 36
39.PE1: R80.1 U30.2(A1) ; also sheet 36
39.PE4: R81.1 U30.3(A2) ; also sheet 36
GND [supply]: C118.2 C119.2 J12.1 J12.3 J12.5 J12.7 J12.9 J12.11 J12.13 J12.15 J12.17 J12.19 U29.11(GND) U30.4(GND) ; also sheet 2,3,4,5,6,7,9,10,11,12,13,14,15,16,17,18,19,20,21,22,23,24,25,26,27,28,29,30,31,32,33,35,36,37,38,39,40,41,42,43,44,45
P1$37: J13.1 RP7.9 U29.20(B1)
P2$37: J13.2 RP7.10 U29.18(B2)
P3$37: J13.3 RP7.11 U29.17(B3)
P4$37: J13.4 RP7.12 U29.16(B4)
P5$37: J13.5 RP7.13 U29.15(B5)
P6$37: J13.6 RP7.14 U29.14(B6)
P7$37: J13.7 RP7.15 U29.13(B7)
P8$37: J13.8 RP7.16 U29.12(B8)
P9$37: J13.9 R80.2 U30.7(B1)
P10$37: J13.10 R81.2 U30.6(B2)
PWR$37 [supply]: J12.2 J12.4 J12.6 J12.8 J12.10 J12.12 J12.14 J12.16 J12.18 J12.20 R79.1
VCCB$37 [supply]: R78.1 U29.19(VCCB) U30.8(VCCB)

### Notes on the sheet
- 40 Pin GPIO & POWER Header

## Sheet 35 of 45
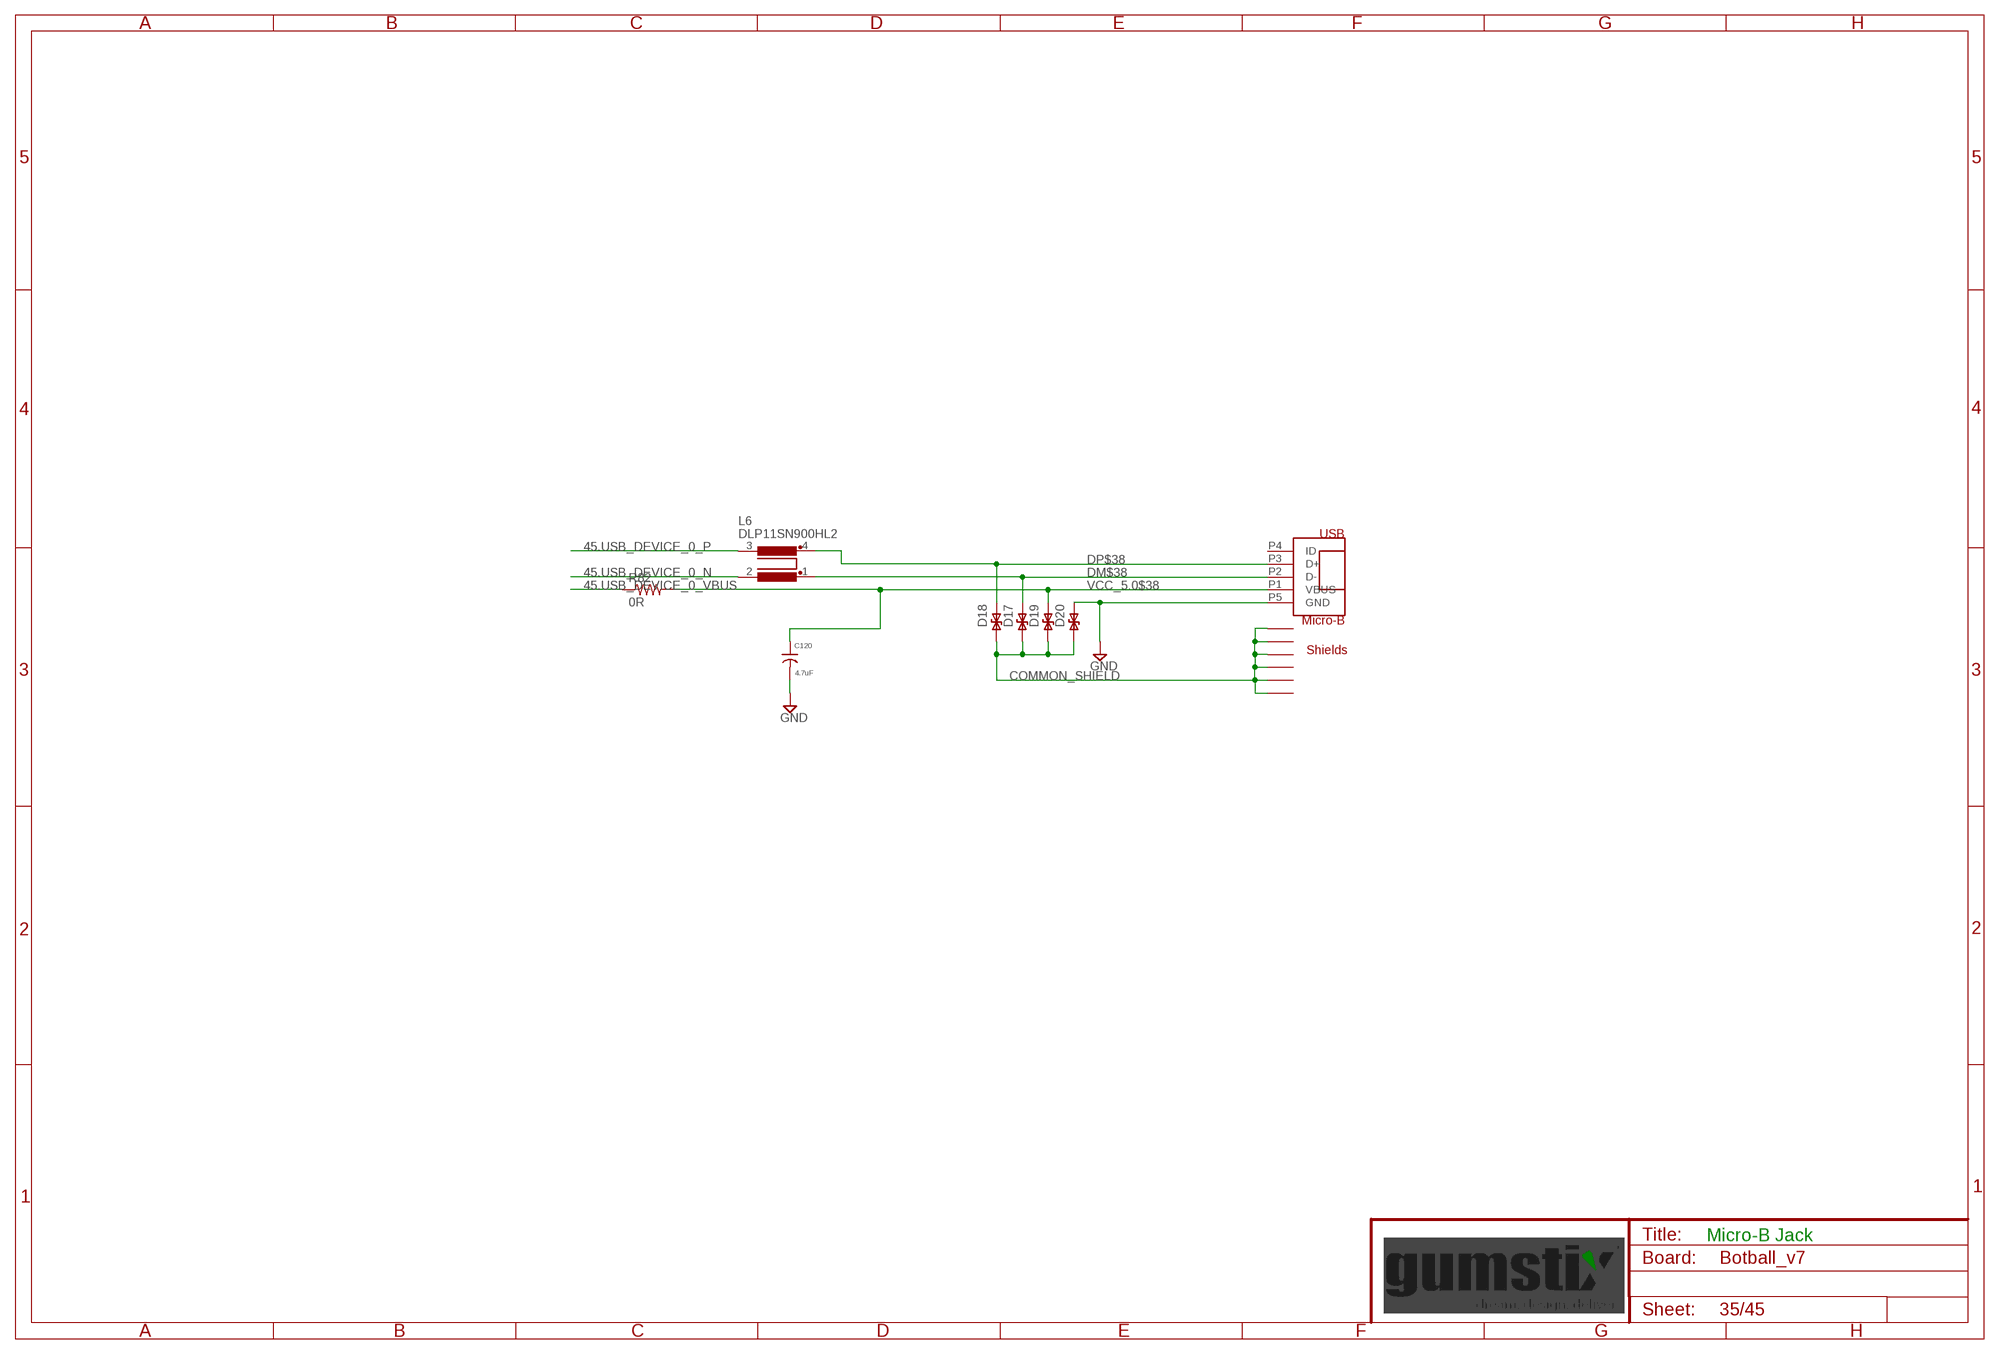
[diagram p34: schematic, sheet 35]

### Parts
C120  4.7uF  C0603  [0603]
D17  PS04LTVA1  ESD-DIODE  [D0402]
D18  PS04LTVA1  ESD-DIODE  [D0402]
D19  B72590D50A060  ESD-DIODE  [D0402]
D20  B72590D50A060  ESD-DIODE  [D0402]
J14  USB_MICRO_B  [USB_MICRO_B]
L6  DLP11SN900HL2  COM_MODE_CHOKE  [0504-DLP11S]
R82  0R  R0402  [0402]

### Nets
45.USB_DEVICE_0_N [USB]: L6.2 ; also sheet 43
45.USB_DEVICE_0_P [USB]: L6.3 ; also sheet 43
45.USB_DEVICE_0_VBUS: R82.1 ; also sheet 43
COMMON_SHIELD [supply]: D17.P1 D18.P1 D19.P1 D20.P1 J14.COMMON_SHEILD1(COMMON_SHIELD1) J14.COMMON_SHEILD2(COMMON_SHIELD2) J14.COMMON_SHEILD3(COMMON_SHIELD3) J14.COMMON_SHEILD4(COMMON_SHIELD4) J14.COMMON_SHEILD5(COMMON_SHIELD5) J14.COMMON_SHEILD6(COMMON_SHIELD6) ; also sheet 15,30,39
DM$38 [USB]: D17.P2 J14.P2(D-) L6.1
DP$38 [USB]: D18.P2 J14.P3(D+) L6.4
GND [supply]: C120.2 D20.P2 J14.P5(GND) ; also sheet 2,3,4,5,6,7,9,10,11,12,13,14,15,16,17,18,19,20,21,22,23,24,25,26,27,28,29,30,31,32,33,34,36,37,38,39,40,41,42,43,44,45
VCC_5.0$38 [supply]: C120.1 D19.P2 J14.P1(VBUS) R82.2
Unconnected: J14.P4(ID)

### Notes on the sheet
- Micro-B Jack

## Sheet 36 of 45
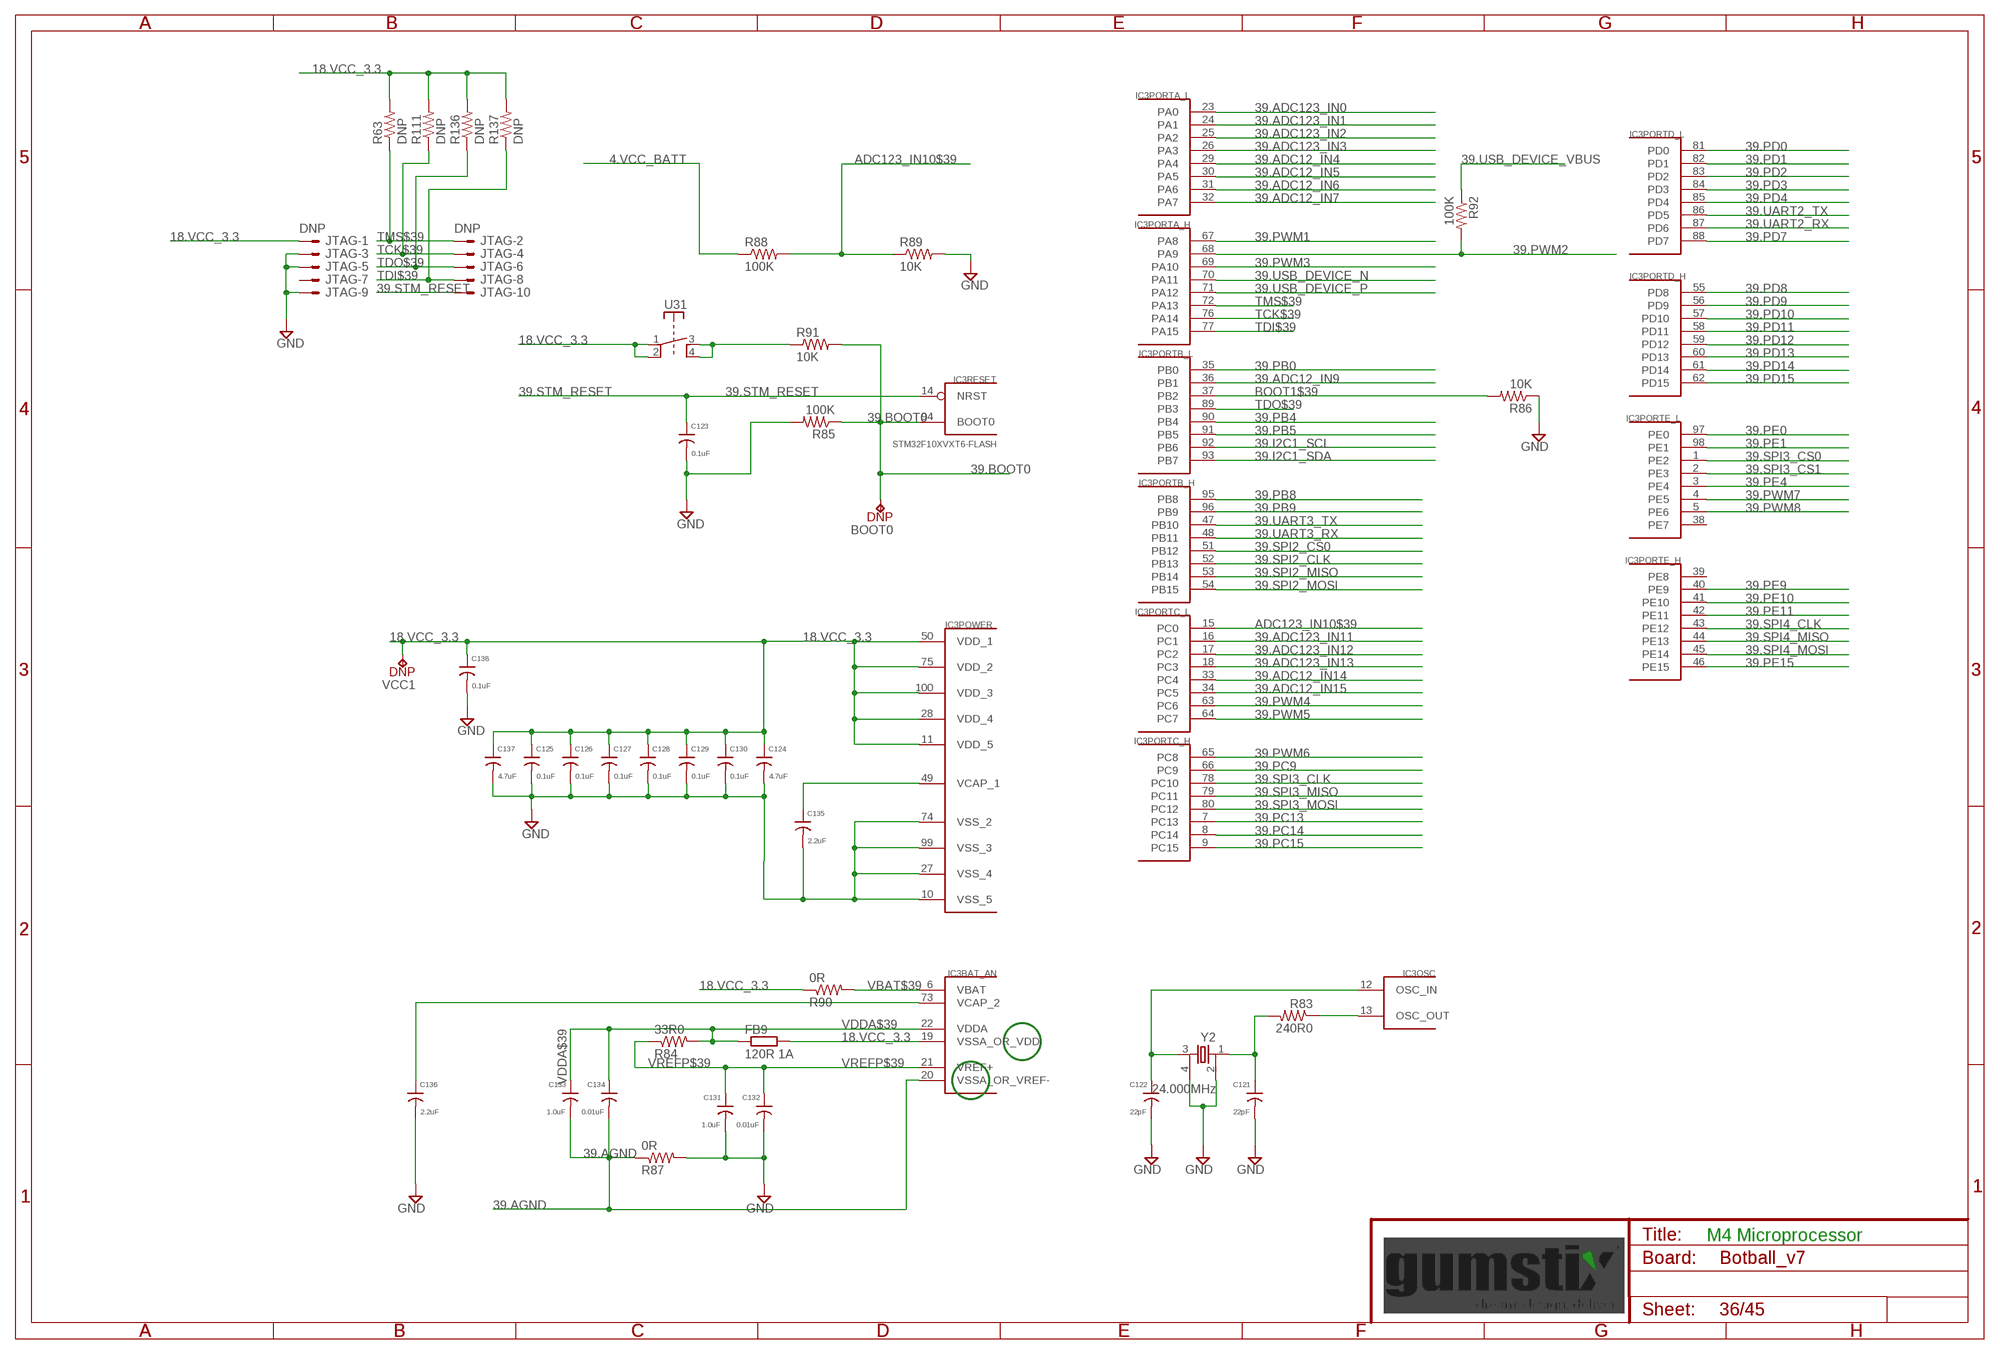
[diagram p35: schematic, sheet 36]

### Parts
BOOT0  DNP  TP05  [TP0500]
C121  22pF  C0402  [0402]
C122  22pF  C0402  [0402]
C123  0.1uF  C0201  [0201]
C124  4.7uF  C0603  [0603]
C125  0.1uF  C0201  [0201]
C126  0.1uF  C0201  [0201]
C127  0.1uF  C0201  [0201]
C128  0.1uF  C0201  [0201]
C129  0.1uF  C0201  [0201]
C130  0.1uF  C0201  [0201]
C131  1.0uF  C0402  [0402]
C132  0.01uF  C0201  [0201]
C133  1.0uF  C0402  [0402]
C134  0.01uF  C0201  [0201]
C135  2.2uF  C0603  [0603]
C136  2.2uF  C0603  [0603]
C137  4.7uF  C0603  [0603]
C138  0.1uF  C0201  [0201]
FB9  120R 1A  FB0402  [0402]
IC3  STM32F10XVXT6-FLASH  STM32F10XVXT6  [TQFP100]
JTAG  DNP  1365-10  [1365-10]
R63  DNP  R0603  [0603]
R83  240R0  R0201  [0201]
R84  33R0  R0201  [0201]
R85  100K  R0402  [0402]
R86  10K  R0201  [0201]
R87  0R  R0201  [0201]
R88  100K  R0201  [0201]
R89  10K  R0201  [0201]
R90  0R  R0201  [0201]
R91  10K  R0201  [0201]
R92  100K  R0201  [0201]
R111  DNP  R0603  [0603]
R136  DNP  R0603  [0603]
R137  DNP  R0603  [0603]
U31  EVQKMT0  [KMT0]
VCC1  DNP  TP05  [TP0500]
Y2  24.000MHz  Y4CRYSTAL-3225  [CRYSTAL-3225]

### Nets
4.VCC_BATT [supply]: R88.1 ; also sheet 5,10
18.VCC_3.3 [supply]: C124.1 C125.1 C126.1 C127.1 C128.1 C129.1 C130.1 C137.1 C138.1 FB9.2 IC3.11(POWER:VDD_5) IC3.19(BAT_AN:VSSA_OR_VDD) IC3.28(POWER:VDD_4) IC3.50(POWER:VDD_1) IC3.75(POWER:VDD_2) IC3.100(POWER:VDD_3) JTAG.1 R63.2 R90.1 R111.2 R136.2 R137.2 U31.1(A) U31.2(A') VCC1.1(TP) ; also sheet 3,4,7,8,9,11,12,13,14,16,17,18,19,20,21,23,24,25,26,27,28,29,31,33,34,37,38,39
39.ADC12_IN4: IC3.29(PORTA_L:PA4) ; also sheet 31
39.ADC12_IN5: IC3.30(PORTA_L:PA5) ; also sheet 31
39.ADC12_IN6: IC3.31(PORTA_L:PA6) ; also sheet 31
39.ADC12_IN7: IC3.32(PORTA_L:PA7) ; also sheet 31
39.ADC12_IN9: IC3.36(PORTB_L:PB1) ; also sheet 8
39.ADC12_IN14: IC3.33(PORTC_L:PC4) ; also sheet 8
39.ADC12_IN15: IC3.34(PORTC_L:PC5) ; also sheet 8
39.ADC123_IN0: IC3.23(PORTA_L:PA0) ; also sheet 7
39.ADC123_IN1: IC3.24(PORTA_L:PA1) ; also sheet 7
39.ADC123_IN2: IC3.25(PORTA_L:PA2) ; also sheet 7
39.ADC123_IN3: IC3.26(PORTA_L:PA3) ; also sheet 7
39.ADC123_IN11: IC3.16(PORTC_L:PC1) ; also sheet 8
39.ADC123_IN12: IC3.17(PORTC_L:PC2) ; also sheet 8
39.ADC123_IN13: IC3.18(PORTC_L:PC3) ; also sheet 8
39.AGND [supply]: C133.2 C134.2 IC3.20(BAT_AN:VSSA_OR_VREF-) R87.1 ; also sheet 8
39.BOOT0: BOOT0.1(TP) IC3.94(RESET:BOOT0) R85.1 R91.2 ; also sheet 37
39.I2C1_SCL: IC3.92(PORTB_L:PB6) ; also sheet 27
39.I2C1_SDA: IC3.93(PORTB_L:PB7) ; also sheet 27
39.PB0: IC3.35(PORTB_L:PB0) ; also sheet 4
39.PB4: IC3.90(PORTB_L:PB4) ; also sheet 9
39.PB5: IC3.91(PORTB_L:PB5) ; also sheet 9
39.PB8: IC3.95(PORTB_H:PB8) ; also sheet 34
39.PB9: IC3.96(PORTB_H:PB9) ; also sheet 34
39.PC9: IC3.66(PORTC_H:PC9) ; also sheet 34
39.PC13: IC3.7(PORTC_H:PC13) ; also sheet 7
39.PC14: IC3.8(PORTC_H:PC14) ; also sheet 31
39.PC15: IC3.9(PORTC_H:PC15) ; also sheet 31
39.PD0: IC3.81(PORTD_L:PD0) ; also sheet 25
39.PD1: IC3.82(PORTD_L:PD1) ; also sheet 7
39.PD2: IC3.83(PORTD_L:PD2) ; also sheet 14
39.PD3: IC3.84(PORTD_L:PD3) ; also sheet 14
39.PD4: IC3.85(PORTD_L:PD4) ; also sheet 14
39.PD7: IC3.88(PORTD_L:PD7) ; also sheet 7
39.PD8: IC3.55(PORTD_H:PD8) ; also sheet 11
39.PD9: IC3.56(PORTD_H:PD9) ; also sheet 11
39.PD10: IC3.57(PORTD_H:PD10) ; also sheet 31
39.PD11: IC3.58(PORTD_H:PD11) ; also sheet 31
39.PD12: IC3.59(PORTD_H:PD12) ; also sheet 34
39.PD13: IC3.60(PORTD_H:PD13) ; also sheet 34
39.PD14: IC3.61(PORTD_H:PD14) ; also sheet 34
39.PD15: IC3.62(PORTD_H:PD15) ; also sheet 34
39.PE0: IC3.97(PORTE_L:PE0) ; also sheet 34
39.PE1: IC3.98(PORTE_L:PE1) ; also sheet 34
39.PE4: IC3.3(PORTE_L:PE4) ; also sheet 34
39.PE9: IC3.40(PORTE_H:PE9) ; also sheet 26
39.PE10: IC3.41(PORTE_H:PE10) ; also sheet 22
39.PE11: IC3.42(PORTE_H:PE11) ; also sheet 25
39.PE15: IC3.46(PORTE_H:PE15) ; also sheet 7
39.PWM1: IC3.67(PORTA_H:PA8) ; also sheet 7
39.PWM2: IC3.68(PORTA_H:PA9) R92.2 ; also sheet 7
39.PWM3: IC3.69(PORTA_H:PA10) ; also sheet 31
39.PWM4: IC3.63(PORTC_L:PC6) ; also sheet 31
39.PWM5: IC3.64(PORTC_L:PC7) ; also sheet 3
39.PWM6: IC3.65(PORTC_H:PC8) ; also sheet 3
39.PWM7: IC3.4(PORTE_L:PE5) ; also sheet 28
39.PWM8: IC3.5(PORTE_L:PE6) ; also sheet 28
39.SPI2_CLK: IC3.52(PORTB_H:PB13) ; also sheet 9
39.SPI2_CS0: IC3.51(PORTB_H:PB12) ; also sheet 9
39.SPI2_MISO: IC3.53(PORTB_H:PB14) ; also sheet 9
39.SPI2_MOSI: IC3.54(PORTB_H:PB15) ; also sheet 9
39.SPI3_CLK: IC3.78(PORTC_H:PC10) ; also sheet 14
39.SPI3_CS0: IC3.1(PORTE_L:PE2) ; also sheet 14
39.SPI3_CS1: IC3.2(PORTE_L:PE3) ; also sheet 14
39.SPI3_MISO: IC3.79(PORTC_H:PC11) ; also sheet 14
39.SPI3_MOSI: IC3.80(PORTC_H:PC12) ; also sheet 14
39.SPI4_CLK: IC3.43(PORTE_H:PE12) ; also sheet 25
39.SPI4_MISO: IC3.44(PORTE_H:PE13) ; also sheet 25
39.SPI4_MOSI: IC3.45(PORTE_H:PE14) ; also sheet 25
39.STM_RESET: C123.1 IC3.14(RESET:NRST) JTAG.10 ; also sheet 37
39.UART2_RX: IC3.87(PORTD_L:PD6) ; also sheet 13
39.UART2_TX: IC3.86(PORTD_L:PD5) ; also sheet 13
39.UART3_RX: IC3.48(PORTB_H:PB11) ; also sheet 17
39.UART3_TX: IC3.47(PORTB_H:PB10) ; also sheet 17
39.USB_DEVICE_N [USB]: IC3.70(PORTA_H:PA11) ; also sheet 30
39.USB_DEVICE_P [USB]: IC3.71(PORTA_H:PA12) ; also sheet 30
39.USB_DEVICE_VBUS [supply]: R92.1 ; also sheet 30
ADC123_IN10$39: IC3.15(PORTC_L:PC0) R88.2 R89.1
BOOT0_VCC$39: R91.1 U31.3(B) U31.4(B')
BOOT1$39: IC3.37(PORTB_L:PB2) R86.2
GND [supply]: C121.2 C122.2 C123.2 C124.2 C125.2 C126.2 C127.2 C128.2 C129.2 C130.2 C131.2 C132.2 C135.2 C136.2 C137.2 C138.2 IC3.10(POWER:VSS_5) IC3.27(POWER:VSS_4) IC3.74(POWER:VSS_2) IC3.99(POWER:VSS_3) JTAG.3 JTAG.5 JTAG.9 R85.2 R86.1 R87.2 R89.2 Y2.2 Y2.4 ; also sheet 2,3,4,5,6,7,9,10,11,12,13,14,15,16,17,18,19,20,21,22,23,24,25,26,27,28,29,30,31,32,33,34,35,37,38,39,40,41,42,43,44,45
LM3S_OSC0$39: IC3.13(OSC:OSC_OUT) R83.1
STM_OSC1$39: C122.1 IC3.12(OSC:OSC_IN) Y2.3
STM_OSC2$39: C121.1 R83.2 Y2.1
TCK$39: IC3.76(PORTA_H:PA14) JTAG.4 R111.1
TDI$39: IC3.77(PORTA_H:PA15) JTAG.8 R137.1
TDO$39: IC3.89(PORTB_L:PB3) JTAG.6 R136.1
TMS$39: IC3.72(PORTA_H:PA13) JTAG.2 R63.1
VBAT$39: IC3.6(BAT_AN:VBAT) R90.2
VCAP_1$39: C135.1 IC3.49(POWER:VCAP_1)
VCAP_2$39: C136.1 IC3.73(BAT_AN:VCAP_2)
VDDA$39 [supply]: C133.1 C134.1 FB9.1 IC3.22(BAT_AN:VDDA) R84.2
VREFP$39: C131.1 C132.1 IC3.21(BAT_AN:VREF+) R84.1
Unconnected: IC3.38(PORTE_L:PE7) IC3.39(PORTE_H:PE8) JTAG.7

### Notes on the sheet
- M4 Microprocessor

## Sheet 37 of 45
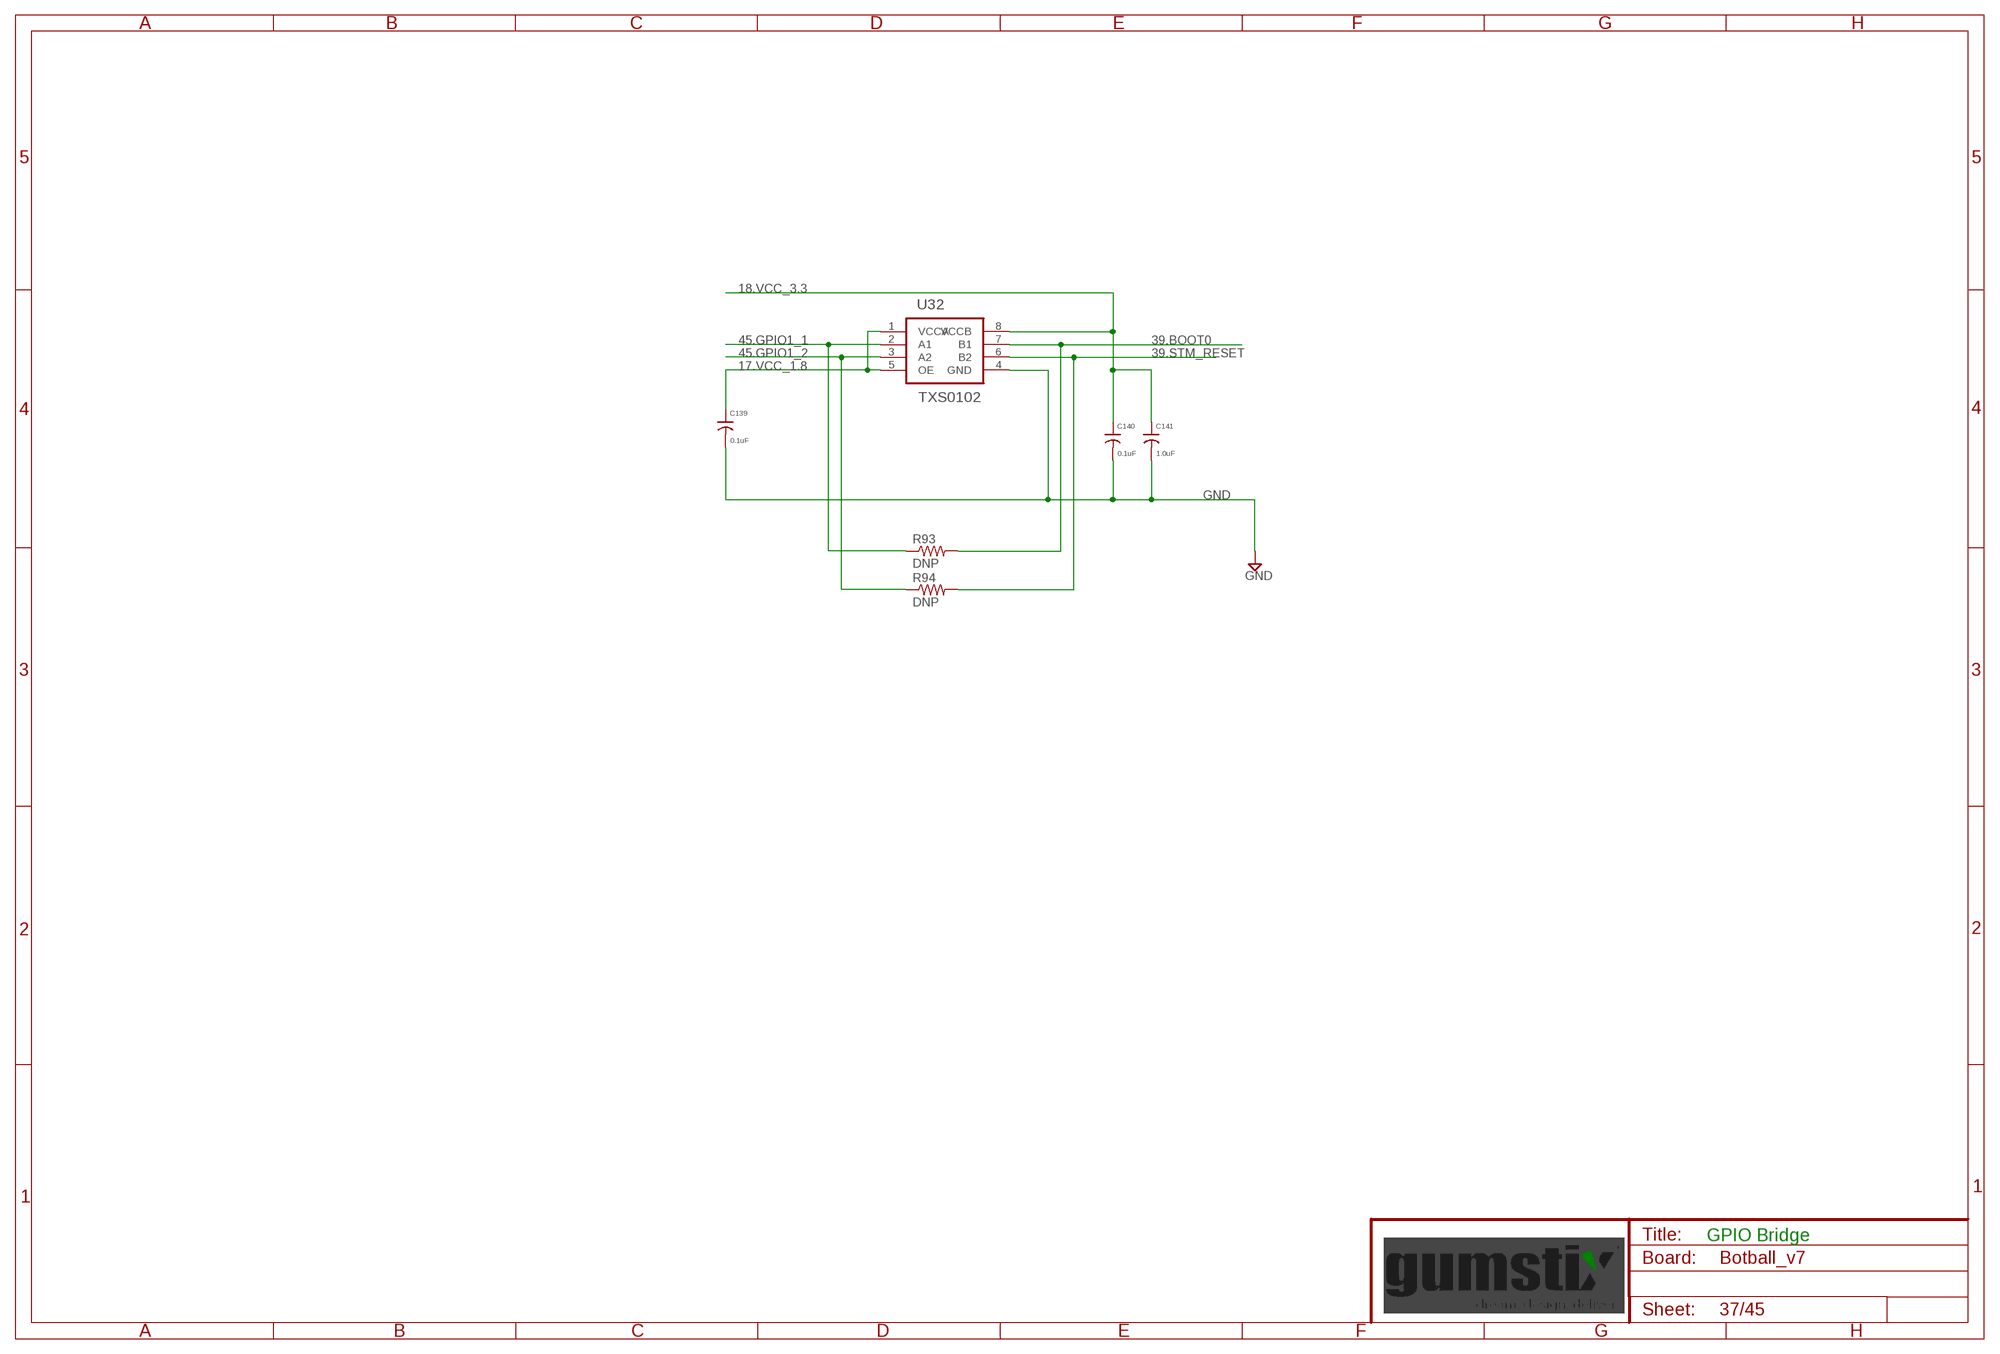
[diagram p36: schematic, sheet 37]

### Parts
C139  0.1uF  C0201  [0201]
C140  0.1uF  C0201  [0201]
C141  1.0uF  C0201  [0201]
R93  DNP  R0201  [0201]
R94  DNP  R0201  [0201]
U32  TXS0102  [DFN8-0.4P]

### Nets
17.VCC_1.8 [supply]: C139.1 U32.1(VCCA) U32.5(OE) ; also sheet 2,6,9,11,16,17,18,32,33,38,39
18.VCC_3.3 [supply]: C140.1 C141.1 U32.8(VCCB) ; also sheet 3,4,7,8,9,11,12,13,14,16,17,18,19,20,21,23,24,25,26,27,28,29,31,33,34,36,38,39
39.BOOT0: R93.2 U32.7(B1) ; also sheet 36
39.STM_RESET: R94.2 U32.6(B2) ; also sheet 36
45.GPIO1_1: R93.1 U32.2(A1) ; also sheet 42
45.GPIO1_2: R94.1 U32.3(A2) ; also sheet 42
GND [supply]: C139.2 C140.2 C141.2 U32.4(GND) ; also sheet 2,3,4,5,6,7,9,10,11,12,13,14,15,16,17,18,19,20,21,22,23,24,25,26,27,28,29,30,31,32,33,34,35,36,38,39,40,41,42,43,44,45

### Notes on the sheet
- GPIO Bridge

## Sheet 38 of 45
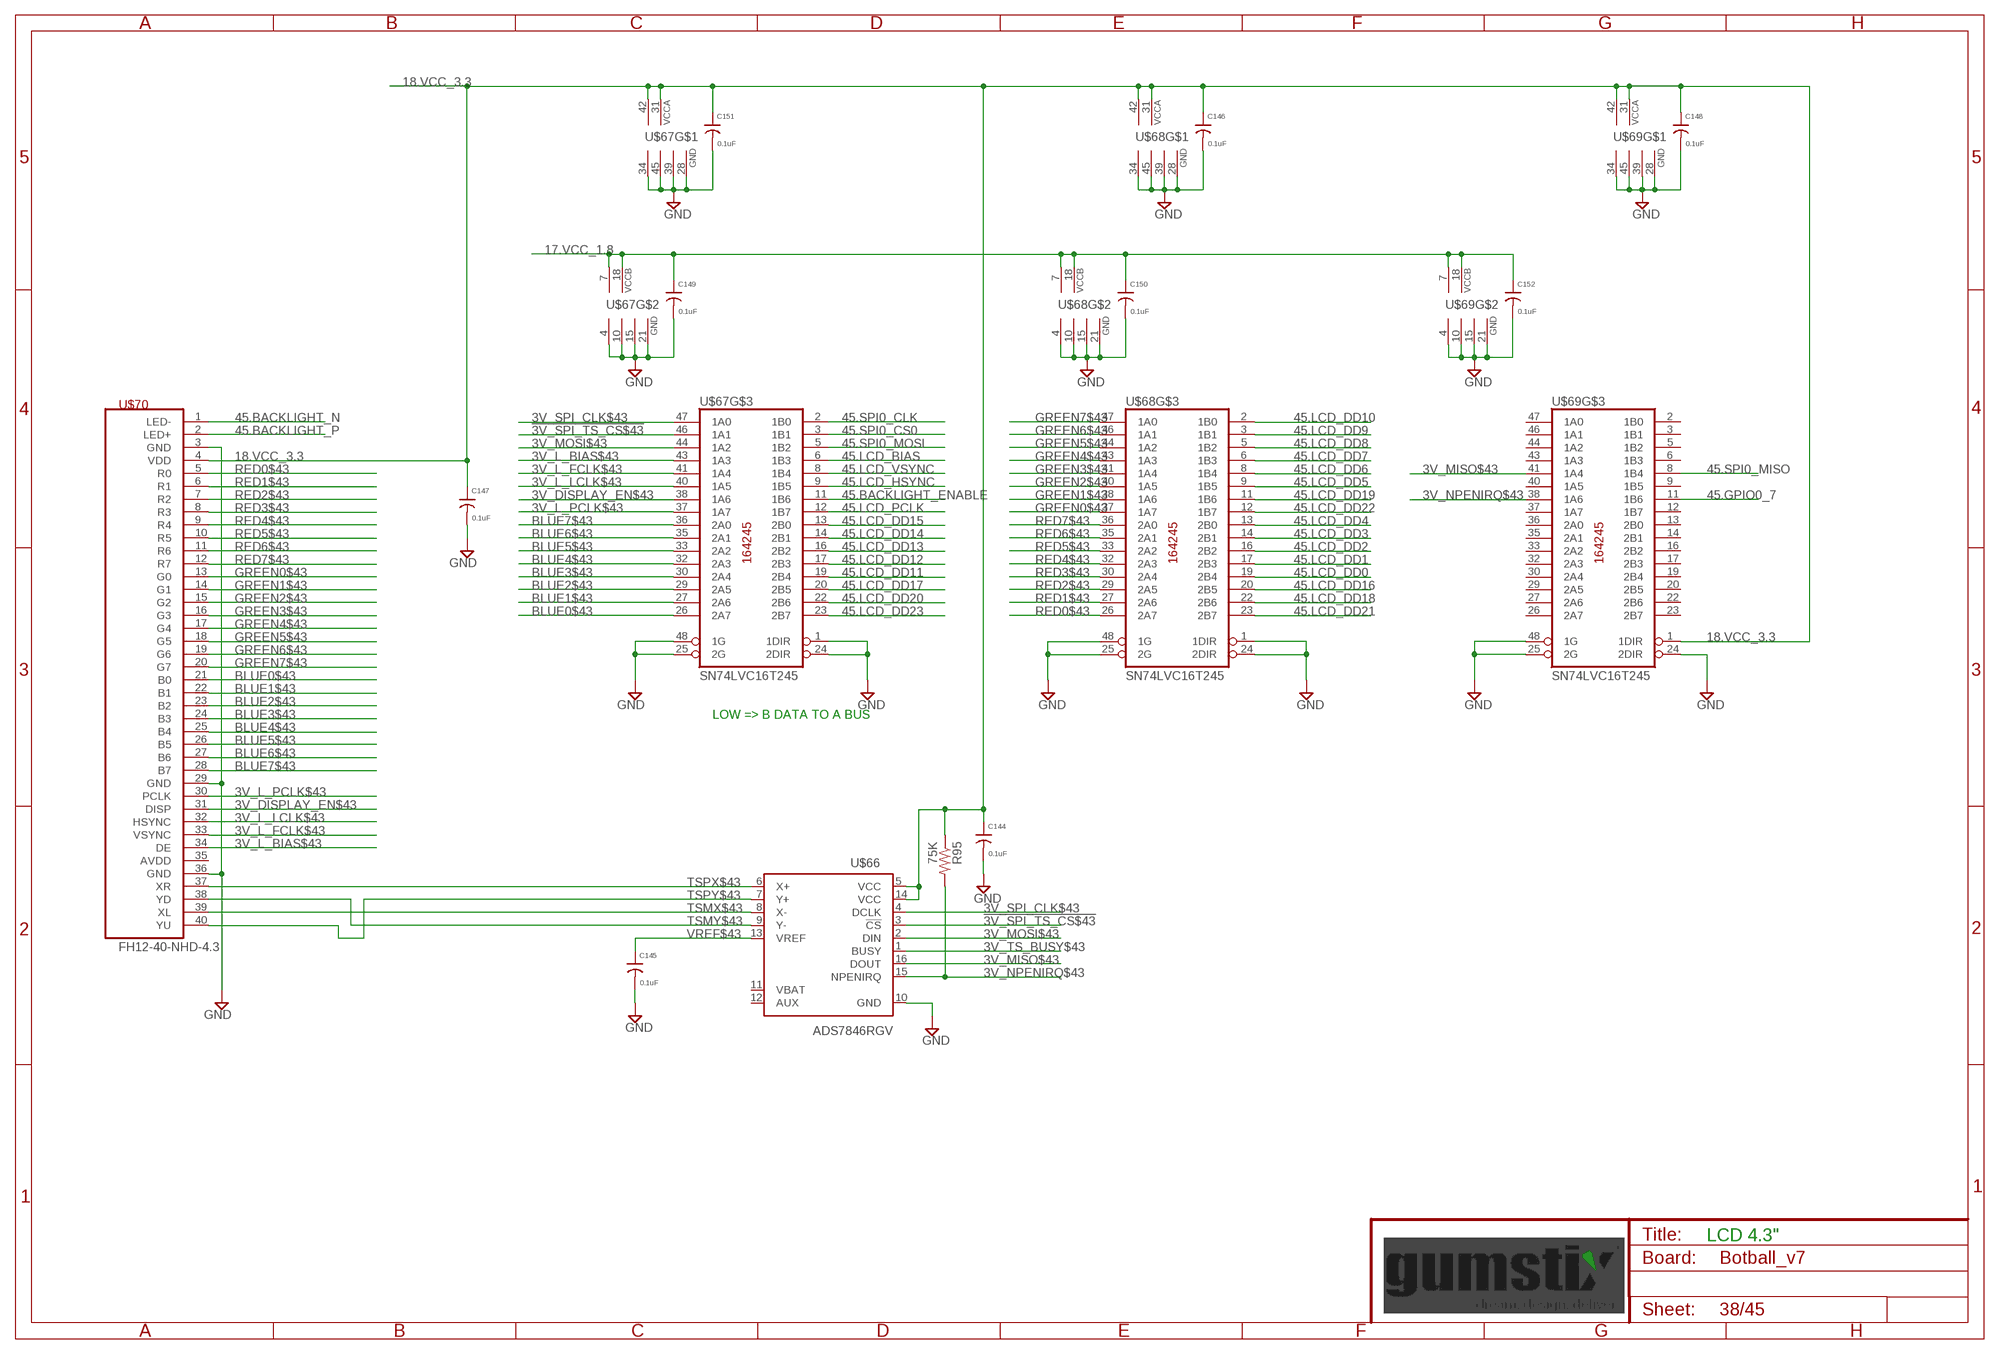
[diagram p37: schematic, sheet 38]

### Parts
C144  0.1uF  C0201  [0201]
C145  0.1uF  C0201  [0201]
C146  0.1uF  C0201  [0201]
C147  0.1uF  C0201  [0201]
C148  0.1uF  C0201  [0201]
C149  0.1uF  C0201  [0201]
C150  0.1uF  C0201  [0201]
C151  0.1uF  C0201  [0201]
C152  0.1uF  C0201  [0201]
R95  75K  R0402  [0402]
U$66  ADS7846RGV  [QFN16]
U$67  SN74LVC16T245  74AC164245TVSOP  [TVSOP48]
U$68  SN74LVC16T245  74AC164245TVSOP  [TVSOP48]
U$69  SN74LVC16T245  74AC164245TVSOP  [TVSOP48]
U$70  FH12-40-NHD-4.3  FH12-40-NHD-4.3"  [FH12-40S-0.5SH]

### Nets
3V_DISPLAY_EN$43: U$67.38(1A6) U$70.31(DISP)
3V_L_BIAS$43: U$67.43(1A3) U$70.34(DE)
3V_L_FCLK$43: U$67.41(1A4) U$70.33(VSYNC)
3V_L_LCLK$43: U$67.40(1A5) U$70.32(HSYNC)
3V_L_PCLK$43: U$67.37(1A7) U$70.30(PCLK)
3V_MISO$43: U$66.16(DOUT) U$69.41(1A4)
3V_MOSI$43: U$66.2(DIN) U$67.44(1A2)
3V_NPENIRQ$43: R95.2 U$66.15(NPENIRQ) U$69.38(1A6)
3V_SPI_CLK$43: U$66.4(DCLK) U$67.47(1A0)
3V_TS_BUSY$43: U$66.1(BUSY)
17.VCC_1.8 [supply]: C149.1 C150.1 C152.1 U$67.7(VCCB) U$67.18(VCCB) U$68.7(VCCB) U$68.18(VCCB) U$69.7(VCCB) U$69.18(VCCB) ; also sheet 2,6,9,11,16,17,18,32,33,37,39
18.VCC_3.3 [supply]: C144.1 C146.1 C147.1 C148.1 C151.1 R95.1 U$66.5(VCC) U$66.14(VCC) U$67.31(VCCA) U$67.42(VCCA) U$68.31(VCCA) U$68.42(VCCA) U$69.1(1DIR) U$69.31(VCCA) U$69.42(VCCA) U$70.4(VDD) ; also sheet 3,4,7,8,9,11,12,13,14,16,17,18,19,20,21,23,24,25,26,27,28,29,31,33,34,36,37,39
45.BACKLIGHT_ENABLE: U$67.11(1B6) ; also sheet 42
45.BACKLIGHT_N [xxwide]: U$70.1(LED-) ; also sheet 40
45.BACKLIGHT_P [xxwide]: U$70.2(LED+) ; also sheet 40
45.GPIO0_7: U$69.11(1B6) ; also sheet 44
45.LCD_BIAS: U$67.6(1B3) ; also sheet 39,42
45.LCD_DD0: U$68.19(2B4) ; also sheet 39,42
45.LCD_DD1: U$68.17(2B3) ; also sheet 39,42
45.LCD_DD2: U$68.16(2B2) ; also sheet 39,42
45.LCD_DD3: U$68.14(2B1) ; also sheet 39,42
45.LCD_DD4: U$68.13(2B0) ; also sheet 39,42
45.LCD_DD5: U$68.9(1B5) ; also sheet 39,42
45.LCD_DD6: U$68.8(1B4) ; also sheet 39,42
45.LCD_DD7: U$68.6(1B3) ; also sheet 39,42
45.LCD_DD8: U$68.5(1B2) ; also sheet 39,42
45.LCD_DD9: U$68.3(1B1) ; also sheet 39,42
45.LCD_DD10: U$68.2(1B0) ; also sheet 39,42
45.LCD_DD11: U$67.19(2B4) ; also sheet 39,42
45.LCD_DD12: U$67.17(2B3) ; also sheet 39,42
45.LCD_DD13: U$67.16(2B2) ; also sheet 39,42
45.LCD_DD14: U$67.14(2B1) ; also sheet 39,42
45.LCD_DD15: U$67.13(2B0) ; also sheet 39,42
45.LCD_DD16: U$68.20(2B5) ; also sheet 39,42
45.LCD_DD17: U$67.20(2B5) ; also sheet 39,42
45.LCD_DD18: U$68.22(2B6) ; also sheet 39,42
45.LCD_DD19: U$68.11(1B6) ; also sheet 39,42
45.LCD_DD20: U$67.22(2B6) ; also sheet 39,42
45.LCD_DD21: U$68.23(2B7) ; also sheet 39,42
45.LCD_DD22: U$68.12(1B7) ; also sheet 39,42
45.LCD_DD23: U$67.23(2B7) ; also sheet 39,42
45.LCD_HSYNC: U$67.9(1B5) ; also sheet 39,42
45.LCD_PCLK: U$67.12(1B7) ; also sheet 39,42
45.LCD_VSYNC: U$67.8(1B4) ; also sheet 39,42
45.SPI0_CLK: U$67.2(1B0) ; also sheet 43
45.SPI0_CS0: U$67.3(1B1) ; also sheet 43
45.SPI0_MISO: U$69.8(1B4) ; also sheet 43
45.SPI0_MOSI: U$67.5(1B2) ; also sheet 43
!3V_SPI_TS_CS$43: U$66.3(!CS) U$67.46(1A1)
BLUE0$43: U$67.26(2A7) U$70.21(B0)
BLUE1$43: U$67.27(2A6) U$70.22(B1)
BLUE2$43: U$67.29(2A5) U$70.23(B2)
BLUE3$43: U$67.30(2A4) U$70.24(B3)
BLUE4$43: U$67.32(2A3) U$70.25(B4)
BLUE5$43: U$67.33(2A2) U$70.26(B5)
BLUE6$43: U$67.35(2A1) U$70.27(B6)
BLUE7$43: U$67.36(2A0) U$70.28(B7)
GND [supply]: C144.2 C145.2 C146.2 C147.2 C148.2 C149.2 C150.2 C151.2 C152.2 U$66.10(GND) U$67.1(1DIR) U$67.4(GND) U$67.10(GND) U$67.15(GND) U$67.21(GND) U$67.24(2DIR) U$67.25(2G) U$67.28(GND) U$67.34(GND) U$67.39(GND) U$67.45(GND) U$67.48(1G) U$68.1(1DIR) U$68.4(GND) U$68.10(GND) U$68.15(GND) U$68.21(GND) U$68.24(2DIR) U$68.25(2G) U$68.28(GND) U$68.34(GND) U$68.39(GND) U$68.45(GND) U$68.48(1G) U$69.4(GND) U$69.10(GND) U$69.15(GND) U$69.21(GND) U$69.24(2DIR) U$69.25(2G) U$69.28(GND) U$69.34(GND) U$69.39(GND) U$69.45(GND) U$69.48(1G) U$70.3(GND) U$70.29(GND) U$70.36(GND) ; also sheet 2,3,4,5,6,7,9,10,11,12,13,14,15,16,17,18,19,20,21,22,23,24,25,26,27,28,29,30,31,32,33,34,35,36,37,39,40,41,42,43,44,45
GREEN0$43: U$68.37(1A7) U$70.13(G0)
GREEN1$43: U$68.38(1A6) U$70.14(G1)
GREEN2$43: U$68.40(1A5) U$70.15(G2)
GREEN3$43: U$68.41(1A4) U$70.16(G3)
GREEN4$43: U$68.43(1A3) U$70.17(G4)
GREEN5$43: U$68.44(1A2) U$70.18(G5)
GREEN6$43: U$68.46(1A1) U$70.19(G6)
GREEN7$43: U$68.47(1A0) U$70.20(G7)
RED0$43: U$68.26(2A7) U$70.5(R0)
RED1$43: U$68.27(2A6) U$70.6(R1)
RED2$43: U$68.29(2A5) U$70.7(R2)
RED3$43: U$68.30(2A4) U$70.8(R3)
RED4$43: U$68.32(2A3) U$70.9(R4)
RED5$43: U$68.33(2A2) U$70.10(R5)
RED6$43: U$68.35(2A1) U$70.11(R6)
RED7$43: U$68.36(2A0) U$70.12(R7)
TSMX$43 [analog]: U$66.8(X-) U$70.39(XL)
TSMY$43 [analog]: U$66.9(Y-) U$70.38(YD)
TSPX$43 [analog]: U$66.6(X+) U$70.37(XR)
TSPY$43 [analog]: U$66.7(Y+) U$70.40(YU)
VREF$43: C145.1 U$66.13(VREF)
Unconnected: U$66.11(VBAT) U$66.12(AUX) U$69.2(1B0) U$69.3(1B1) U$69.5(1B2) U$69.6(1B3) U$69.9(1B5) U$69.12(1B7) U$69.13(2B0) U$69.14(2B1) U$69.16(2B2) U$69.17(2B3) U$69.19(2B4) U$69.20(2B5) U$69.22(2B6) U$69.23(2B7) U$69.26(2A7) U$69.27(2A6) U$69.29(2A5) U$69.30(2A4) U$69.32(2A3) U$69.33(2A2) U$69.35(2A1) U$69.36(2A0) U$69.37(1A7) U$69.40(1A5) U$69.43(1A3) U$69.44(1A2) U$69.46(1A1) U$69.47(1A0) U$70.35(AVDD)

### Notes on the sheet
- LOW => B DATA TO A BUS
- LCD 4.3"

## Sheet 39 of 45
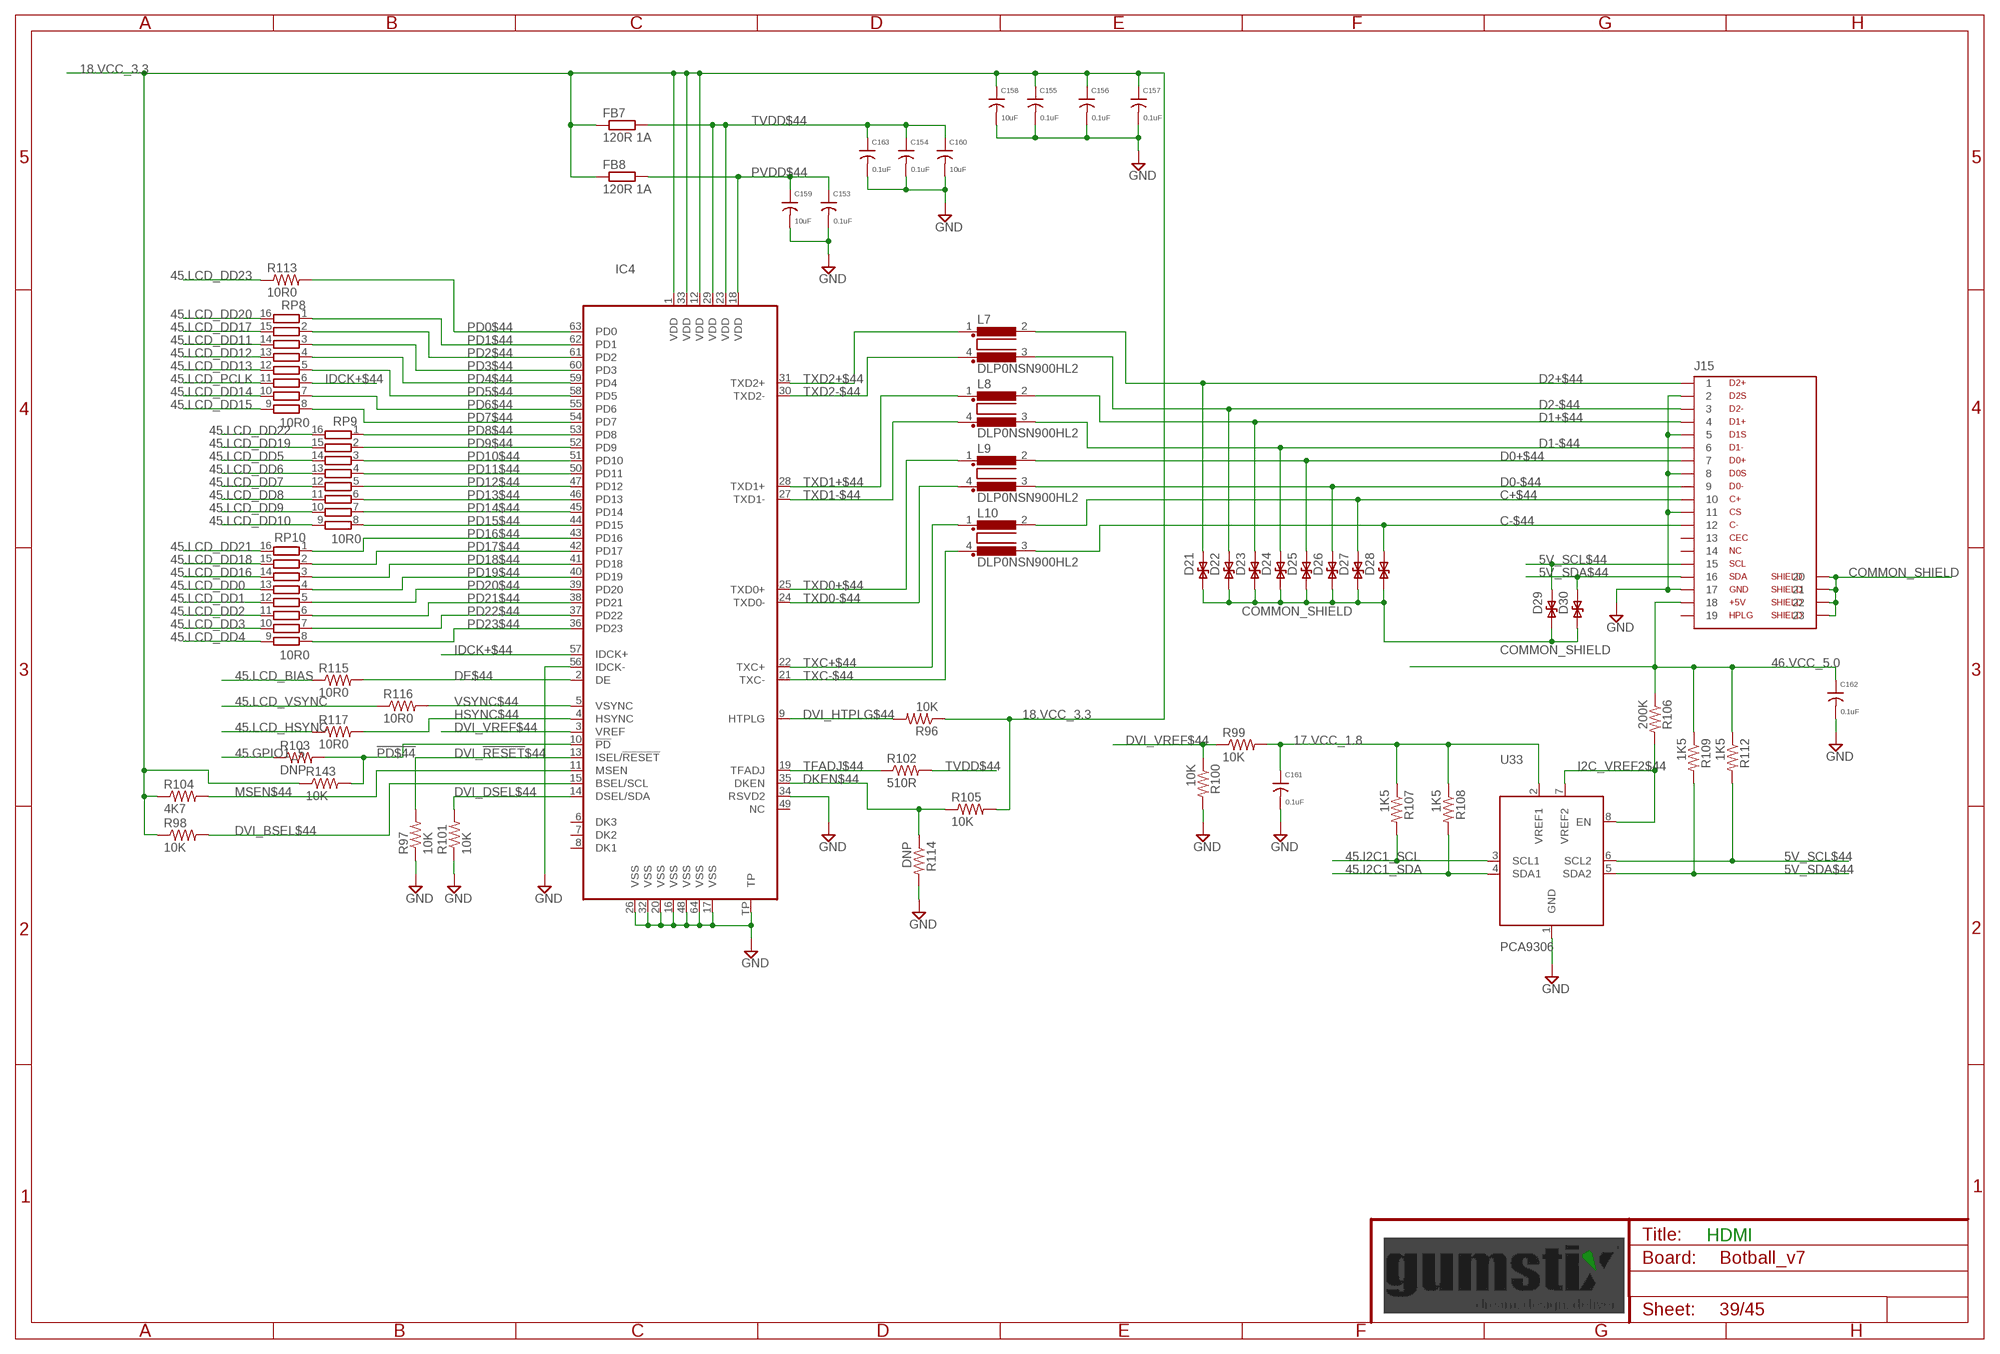
[diagram p38: schematic, sheet 39]

### Parts
C153  0.1uF  C0402  [0402]
C154  0.1uF  C0402  [0402]
C155  0.1uF  C0402  [0402]
C156  0.1uF  C0402  [0402]
C157  0.1uF  C0402  [0402]
C158  10uF  C0603  [0603]
C159  10uF  C0603  [0603]
C160  10uF  C0603  [0603]
C161  0.1uF  C0402  [0402]
C162  0.1uF  C0402  [0402]
C163  0.1uF  C0402  [0402]
D21  PS04LTVA1  ESD-DIODE  [D0402]
D22  PS04LTVA1  ESD-DIODE  [D0402]
D23  PS04LTVA1  ESD-DIODE  [D0402]
D24  PS04LTVA1  ESD-DIODE  [D0402]
D25  PS04LTVA1  ESD-DIODE  [D0402]
D26  PS04LTVA1  ESD-DIODE  [D0402]
D27  PS04LTVA1  ESD-DIODE  [D0402]
D28  PS04LTVA1  ESD-DIODE  [D0402]
D29  PS04LTVA1  ESD-DIODE  [D0402]
D30  PS04LTVA1  ESD-DIODE  [D0402]
FB7  120R 1A  FB0402  [0402]
FB8  120R 1A  FB0402  [0402]
IC4  TFP410  TFP100  [TQFP-64]
J15  HDMIMICRO  [46765-001]
L7  DLP0NSN900HL2  COM_MODE_CHOKE03025  [03025-DLP0NS]
L8  DLP0NSN900HL2  COM_MODE_CHOKE03025  [03025-DLP0NS]
L9  DLP0NSN900HL2  COM_MODE_CHOKE03025  [03025-DLP0NS]
L10  DLP0NSN900HL2  COM_MODE_CHOKE03025  [03025-DLP0NS]
R96  10K  R0402  [0402]
R97  10K  R0402  [0402]
R98  10K  R0402  [0402]
R99  10K  R0402  [0402]
R100  10K  R0402  [0402]
R101  10K  R0402  [0402]
R102  510R  R0402  [0402]
R103  DNP  R0402  [0402]
R104  4K7  R0402  [0402]
R105  10K  R0402  [0402]
R106  200K  R0402  [0402]
R107  1K5  R0402  [0402]
R108  1K5  R0402  [0402]
R109  1K5  R0402  [0402]
R112  1K5  R0402  [0402]
R113  10R0  R0402  [0402]
R114  DNP  R0402  [0402]
R115  10R0  R0402  [0402]
R116  10R0  R0402  [0402]
R117  10R0  R0402  [0402]
R143  10K  R0402  [0402]
RP8  10R0  RP741X163  [741X16]
RP9  10R0  RP741X163  [741X16]
RP10  10R0  RP741X163  [741X16]
U33  PCA9306  [DCT-8(SSOP)]

### Nets
5V_SCL$44: D29.P2 J15.17 R112.2 U33.6(SCL2)
5V_SDA$44: D30.P2 J15.18 R109.2 U33.5(SDA2)
17.VCC_1.8 [supply]: C161.1 R99.2 R107.1 R108.1 U33.2(VREF1) ; also sheet 2,6,9,11,16,17,18,32,33,37,38
18.VCC_3.3 [supply]: C155.1 C156.1 C157.1 C158.1 FB7.1 FB8.1 IC4.1(VDD) IC4.12(VDD) IC4.33(VDD) R96.1 R98.1 R104.1 R105.2 R143.1 ; also sheet 3,4,7,8,9,11,12,13,14,16,17,18,19,20,21,23,24,25,26,27,28,29,31,33,34,36,37,38
45.GPIO1_5: R103.1 ; also sheet 42
45.I2C1_SCL: R107.2 U33.3(SCL1) ; also sheet 6,43
45.I2C1_SDA: R108.2 U33.4(SDA1) ; also sheet 6,43
45.LCD_BIAS: R115.1 ; also sheet 38,42
45.LCD_DD0: RP10.13 ; also sheet 38,42
45.LCD_DD1: RP10.12 ; also sheet 38,42
45.LCD_DD2: RP10.11 ; also sheet 38,42
45.LCD_DD3: RP10.10 ; also sheet 38,42
45.LCD_DD4: RP10.9 ; also sheet 38,42
45.LCD_DD5: RP9.14 ; also sheet 38,42
45.LCD_DD6: RP9.13 ; also sheet 38,42
45.LCD_DD7: RP9.12 ; also sheet 38,42
45.LCD_DD8: RP9.11 ; also sheet 38,42
45.LCD_DD9: RP9.10 ; also sheet 38,42
45.LCD_DD10: RP9.9 ; also sheet 38,42
45.LCD_DD11: RP8.14 ; also sheet 38,42
45.LCD_DD12: RP8.13 ; also sheet 38,42
45.LCD_DD13: RP8.12 ; also sheet 38,42
45.LCD_DD14: RP8.10 ; also sheet 38,42
45.LCD_DD15: RP8.9 ; also sheet 38,42
45.LCD_DD16: RP10.14 ; also sheet 38,42
45.LCD_DD17: RP8.15 ; also sheet 38,42
45.LCD_DD18: RP10.15 ; also sheet 38,42
45.LCD_DD19: RP9.15 ; also sheet 38,42
45.LCD_DD20: RP8.16 ; also sheet 38,42
45.LCD_DD21: RP10.16 ; also sheet 38,42
45.LCD_DD22: RP9.16 ; also sheet 38,42
45.LCD_DD23: R113.1 ; also sheet 38,42
45.LCD_HSYNC: R117.1 ; also sheet 38,42
45.LCD_PCLK: RP8.11 ; also sheet 38,42
45.LCD_VSYNC: R116.1 ; also sheet 38,42
46.VCC_5.0 [supply]: C162.1 J15.19 R106.1 R109.1 R112.1 ; also sheet 2,10,13,15,25,27,32,40,43,45
!PD$44: IC4.10(!PD) R103.2 R143.2
C+$44: D27.P2 J15.12 L10.2
C-$44: D28.P2 J15.14 L10.3
COMMON_SHIELD [supply]: D21.P1 D22.P1 D23.P1 D24.P1 D25.P1 D26.P1 D27.P1 D28.P1 D29.P1 D30.P1 J15.CON1 J15.CON2 J15.CON3 J15.CON4 ; also sheet 15,30,35
D0+$44: D25.P2 J15.9 L9.2
D0-$44: D26.P2 J15.11 L9.3
D1+$44: D23.P2 J15.6 L8.2
D1-$44: D24.P2 J15.8 L8.3
D2+$44: D21.P2 J15.3 L7.2
D2-$44: D22.P2 J15.5 L7.3
DE$44: IC4.2(DE) R115.2
DKEN$44: IC4.35(DKEN) R105.1 R114.1
DVI_!RESET!$44: IC4.13(ISEL/!RESET) R97.2
DVI_BSEL$44: IC4.15(BSEL/SCL) R98.2
DVI_DSEL$44: IC4.14(DSEL/SDA) R101.2
DVI_HTPLG$44: IC4.9(HTPLG) R96.2
DVI_VREF$44 [supply]: IC4.3(VREF) R99.1 R100.1
GND [supply]: C153.2 C154.2 C155.2 C156.2 C157.2 C158.2 C159.2 C160.2 C161.2 C162.2 C163.2 IC4.16(VSS) IC4.17(VSS) IC4.20(VSS) IC4.26(VSS) IC4.32(VSS) IC4.34(RSVD2) IC4.48(VSS) IC4.56(IDCK-) IC4.64(VSS) IC4.TP J15.4 J15.7 J15.10 J15.13 J15.16 R97.1 R100.2 R101.1 R114.2 U33.1(GND) ; also sheet 2,3,4,5,6,7,9,10,11,12,13,14,15,16,17,18,19,20,21,22,23,24,25,26,27,28,29,30,31,32,33,34,35,36,37,38,40,41,42,43,44,45
HSYNC$44: IC4.4(HSYNC) R117.2
I2C_VREF2$44: R106.2 U33.7(VREF2) U33.8(EN)
IDCK+$44: IC4.57(IDCK+) RP8.6
MSEN$44: IC4.11(MSEN) R104.2
PD0$44: IC4.63(PD0) R113.2
PD1$44: IC4.62(PD1) RP8.1
PD2$44: IC4.61(PD2) RP8.2
PD3$44: IC4.60(PD3) RP8.3
PD4$44: IC4.59(PD4) RP8.4
PD5$44: IC4.58(PD5) RP8.5
PD6$44: IC4.55(PD6) RP8.7
PD7$44: IC4.54(PD7) RP8.8
PD8$44: IC4.53(PD8) RP9.1
PD9$44: IC4.52(PD9) RP9.2
PD10$44: IC4.51(PD10) RP9.3
PD11$44: IC4.50(PD11) RP9.4
PD12$44: IC4.47(PD12) RP9.5
PD13$44: IC4.46(PD13) RP9.6
PD14$44: IC4.45(PD14) RP9.7
PD15$44: IC4.44(PD15) RP9.8
PD16$44: IC4.43(PD16) RP10.1
PD17$44: IC4.42(PD17) RP10.2
PD18$44: IC4.41(PD18) RP10.3
PD19$44: IC4.40(PD19) RP10.4
PD20$44: IC4.39(PD20) RP10.5
PD21$44: IC4.38(PD21) RP10.6
PD22$44: IC4.37(PD22) RP10.7
PD23$44: IC4.36(PD23) RP10.8
PVDD$44 [supply]: C153.1 C159.1 FB8.2 IC4.18(VDD)
TFADJ$44: IC4.19(TFADJ) R102.1
TVDD$44 [supply]: C154.1 C160.1 C163.1 FB7.2 IC4.23(VDD) IC4.29(VDD) R102.2
TXC+$44: IC4.22(TXC+) L10.1
TXC-$44: IC4.21(TXC-) L10.4
TXD0+$44: IC4.25(TXD0+) L9.1
TXD0-$44: IC4.24(TXD0-) L9.4
TXD1+$44: IC4.28(TXD1+) L8.1
TXD1-$44: IC4.27(TXD1-) L8.4
TXD2+$44: IC4.31(TXD2+) L7.1
TXD2-$44: IC4.30(TXD2-) L7.4
VSYNC$44: IC4.5(VSYNC) R116.2
Unconnected: IC4.6(DK3) IC4.7(DK2) IC4.8(DK1) IC4.49(NC) J15.1 J15.2 J15.15

### Notes on the sheet
- HDMI

## Sheet 40 of 45
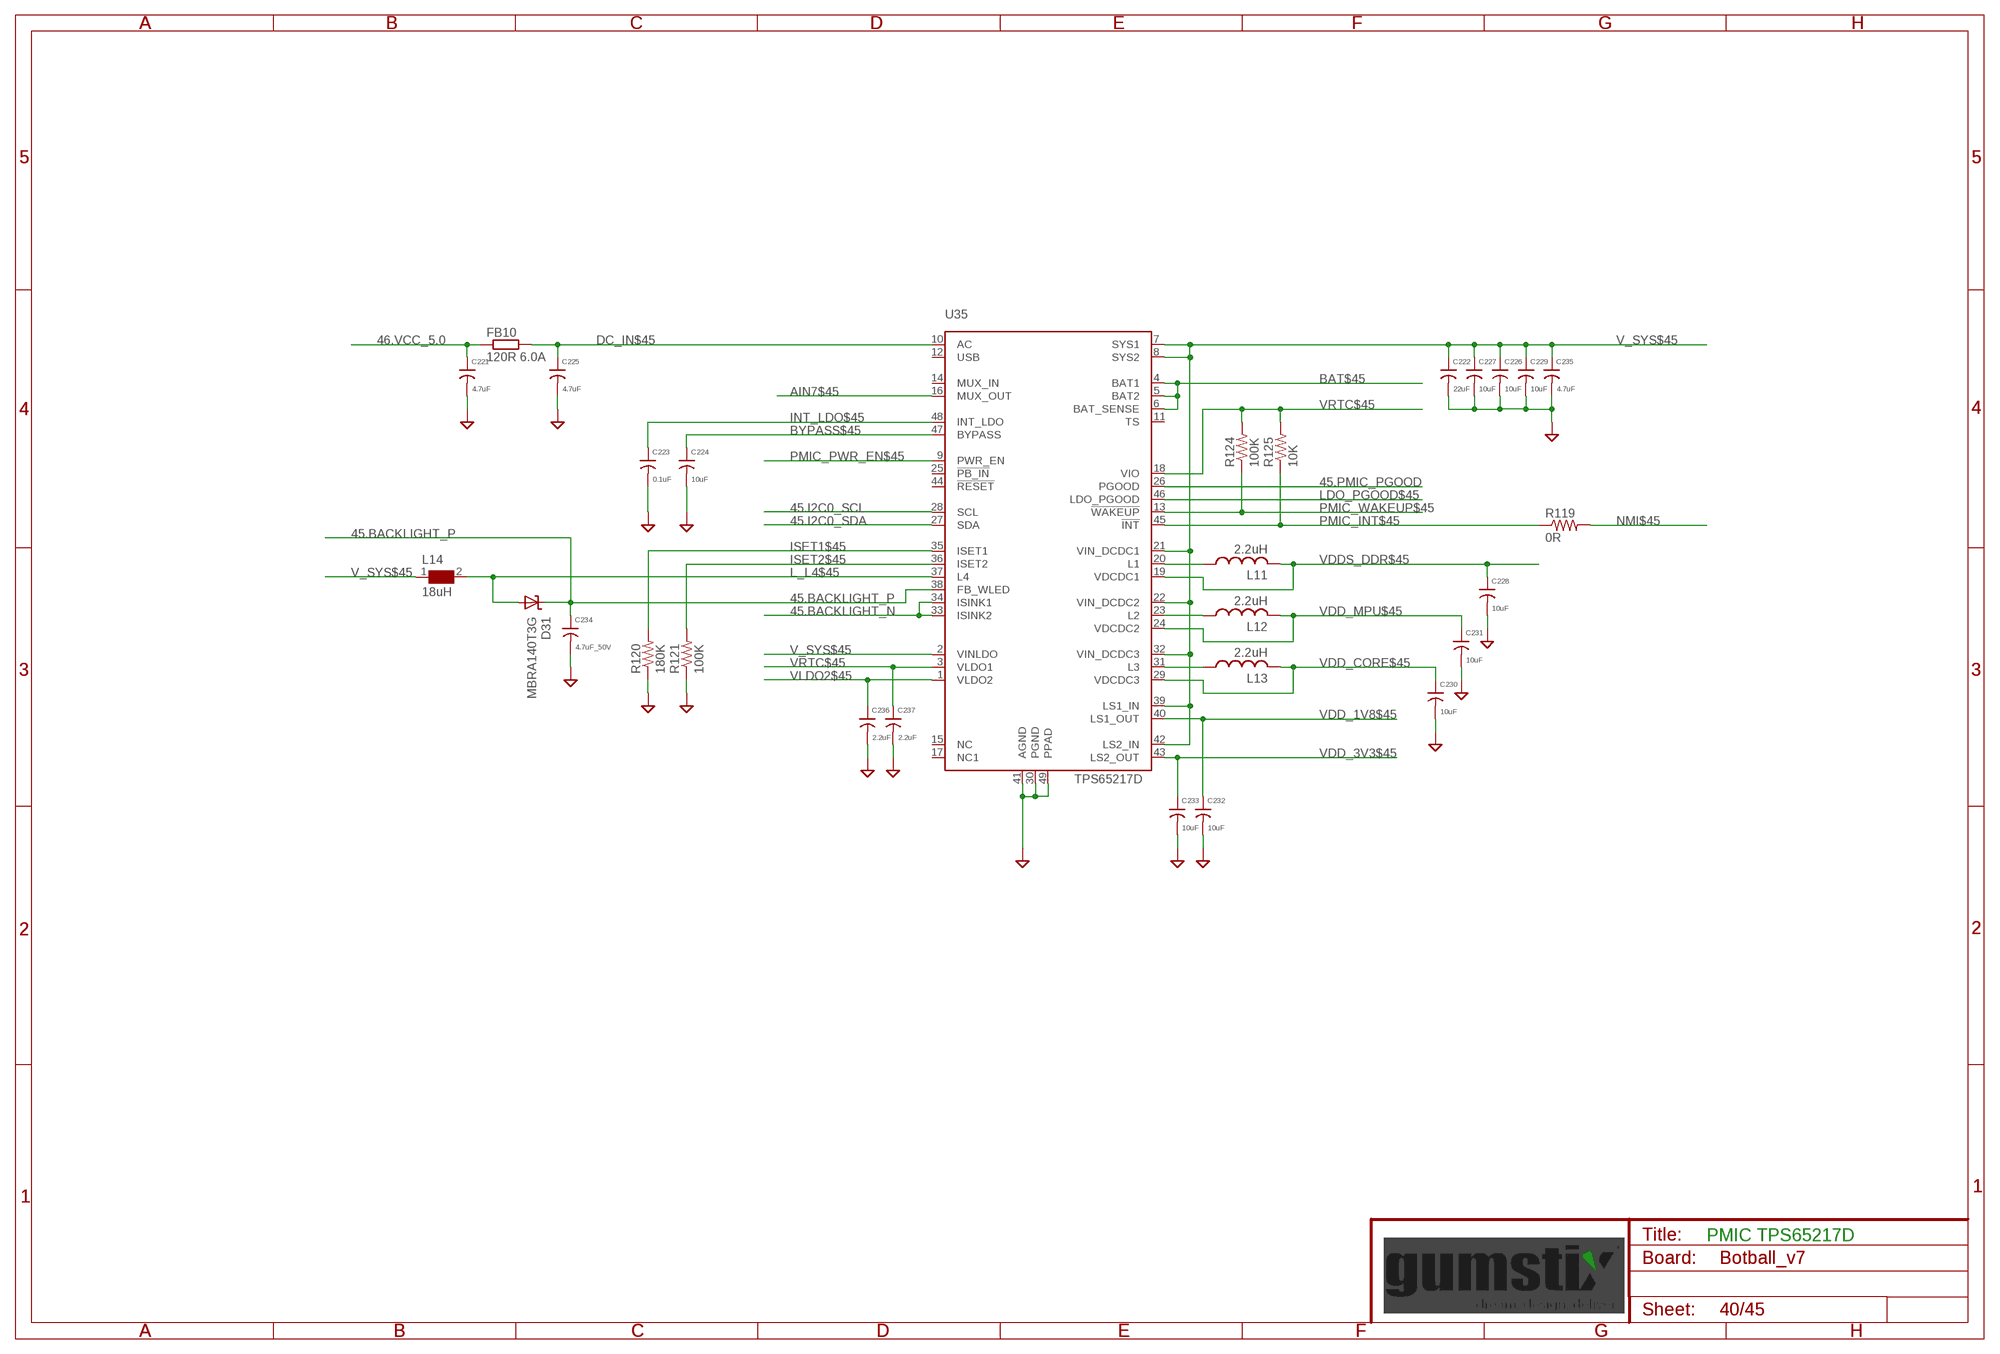
[diagram p39: schematic, sheet 40]

### Parts
C221  4.7uF  C0603  [0603]
C222  22uF  C0805  [0805]
C223  0.1uF  C0201  [0201]
C224  10uF  C0603  [0603]
C225  4.7uF  C0603  [0603]
C226  10uF  C0603  [0603]
C227  10uF  C0603  [0603]
C228  10uF  C0603  [0603]
C229  10uF  C0603  [0603]
C230  10uF  C0603  [0603]
C231  10uF  C0603  [0603]
C232  10uF  C0603  [0603]
C233  10uF  C0603  [0603]
C234  4.7uF_50V  C1210  [1210]
C235  4.7uF  C0603  [0603]
C236  2.2uF  C0402  [0402]
C237  2.2uF  C0402  [0402]
D31  MBRA140T3G  DSMA  [SMAJ]
FB10  120R 6.0A  FB0805  [0805]
L11  2.2uH  L1515  [1515]
L12  2.2uH  L1515  [1515]
L13  2.2uH  L1515  [1515]
L14  18uH  WE-PD2_4532  [WE-PD2_4532]
R119  0R  R0201  [0201]
R120  180K  R0201  [0201]
R121  100K  R0201  [0201]
R124  100K  R0201  [0201]
R125  10K  R0201  [0201]
U35  TPS65217D  TPS65217  [QFN40P600X600X100-49]

### Nets
45.BACKLIGHT_N [xxwide]: U35.33(ISINK2) U35.34(ISINK1) ; also sheet 38
45.BACKLIGHT_P [xxwide]: C234.1 D31.C U35.38(FB_WLED) ; also sheet 38
45.I2C0_SCL: U35.28(SCL) ; also sheet 16,41,42
45.I2C0_SDA: U35.27(SDA) ; also sheet 16,41,42
45.PMIC_PGOOD: U35.26(PGOOD) ; also sheet 18,43
46.VCC_5.0 [supply]: C221.1 FB10.1 ; also sheet 2,10,13,15,25,27,32,39,43,45
AIN7$45 [analog]: U35.16(MUX_OUT) ; also sheet 42
BAT$45: U35.4(BAT1) U35.5(BAT2) U35.6(BAT_SENSE)
BYPASS$45: C224.1 U35.47(BYPASS)
DC_IN$45 [supply]: C225.1 FB10.2 U35.10(AC)
GND [supply]: C221.2 C222.2 C223.2 C224.2 C225.2 C226.2 C227.2 C228.2 C229.2 C230.2 C231.2 C232.2 C233.2 C234.2 C235.2 C236.2 C237.2 R120.1 R121.1 U35.30(PGND) U35.41(AGND) U35.49(PPAD) ; also sheet 2,3,4,5,6,7,9,10,11,12,13,14,15,16,17,18,19,20,21,22,23,24,25,26,27,28,29,30,31,32,33,34,35,36,37,38,39,41,42,43,44,45
INT_LDO$45: C223.1 U35.48(INT_LDO)
ISET1$45: R120.2 U35.35(ISET1)
ISET2$45: R121.2 U35.36(ISET2)
L_L1$45: L11.1 U35.20(L1)
L_L2$45: L12.1 U35.23(L2)
L_L3$45: L13.1 U35.31(L3)
L_L4$45: D31.A L14.2 U35.37(L4)
LDO_PGOOD$45: U35.46(LDO_PGOOD) ; also sheet 43
NMI$45: R119.2 ; also sheet 44
PMIC_INT$45: R119.1 R125.1 U35.45(!INT)
PMIC_PWR_EN$45: U35.9(PWR_EN) ; also sheet 43
PMIC_WAKEUP$45: R124.1 U35.13(!WAKEUP) ; also sheet 44
V_SYS$45 [supply]: C222.1 C226.1 C227.1 C229.1 C235.1 L14.1 U35.2(VINLDO) U35.7(SYS1) U35.8(SYS2) U35.21(VIN_DCDC1) U35.22(VIN_DCDC2) U35.32(VIN_DCDC3) U35.39(LS1_IN) U35.42(LS2_IN)
VDD_1V8$45 [supply]: C232.1 U35.40(LS1_OUT) ; also sheet 41,42,43,44
VDD_3V3$45 [supply]: C233.1 U35.43(LS2_OUT) ; also sheet 44
VDD_CORE$45 [supply]: C230.1 L13.2 U35.29(VDCDC3) ; also sheet 44
VDD_MPU$45 [supply]: C231.1 L12.2 U35.24(VDCDC2) ; also sheet 44
VDDS_DDR$45 [supply]: C228.1 L11.2 U35.19(VDCDC1) ; also sheet 41,44
VLDO2$45: C236.1 U35.1(VLDO2)
VRTC$45: C237.1 R124.2 R125.2 U35.3(VLDO1) U35.18(VIO) ; also sheet 44
Unconnected: U35.11(TS) U35.12(USB) U35.14(MUX_IN) U35.15(NC) U35.17(NC1) U35.25(!PB_IN) U35.44(!RESET)

### Notes on the sheet
- PMIC TPS65217D

## Sheet 41 of 45
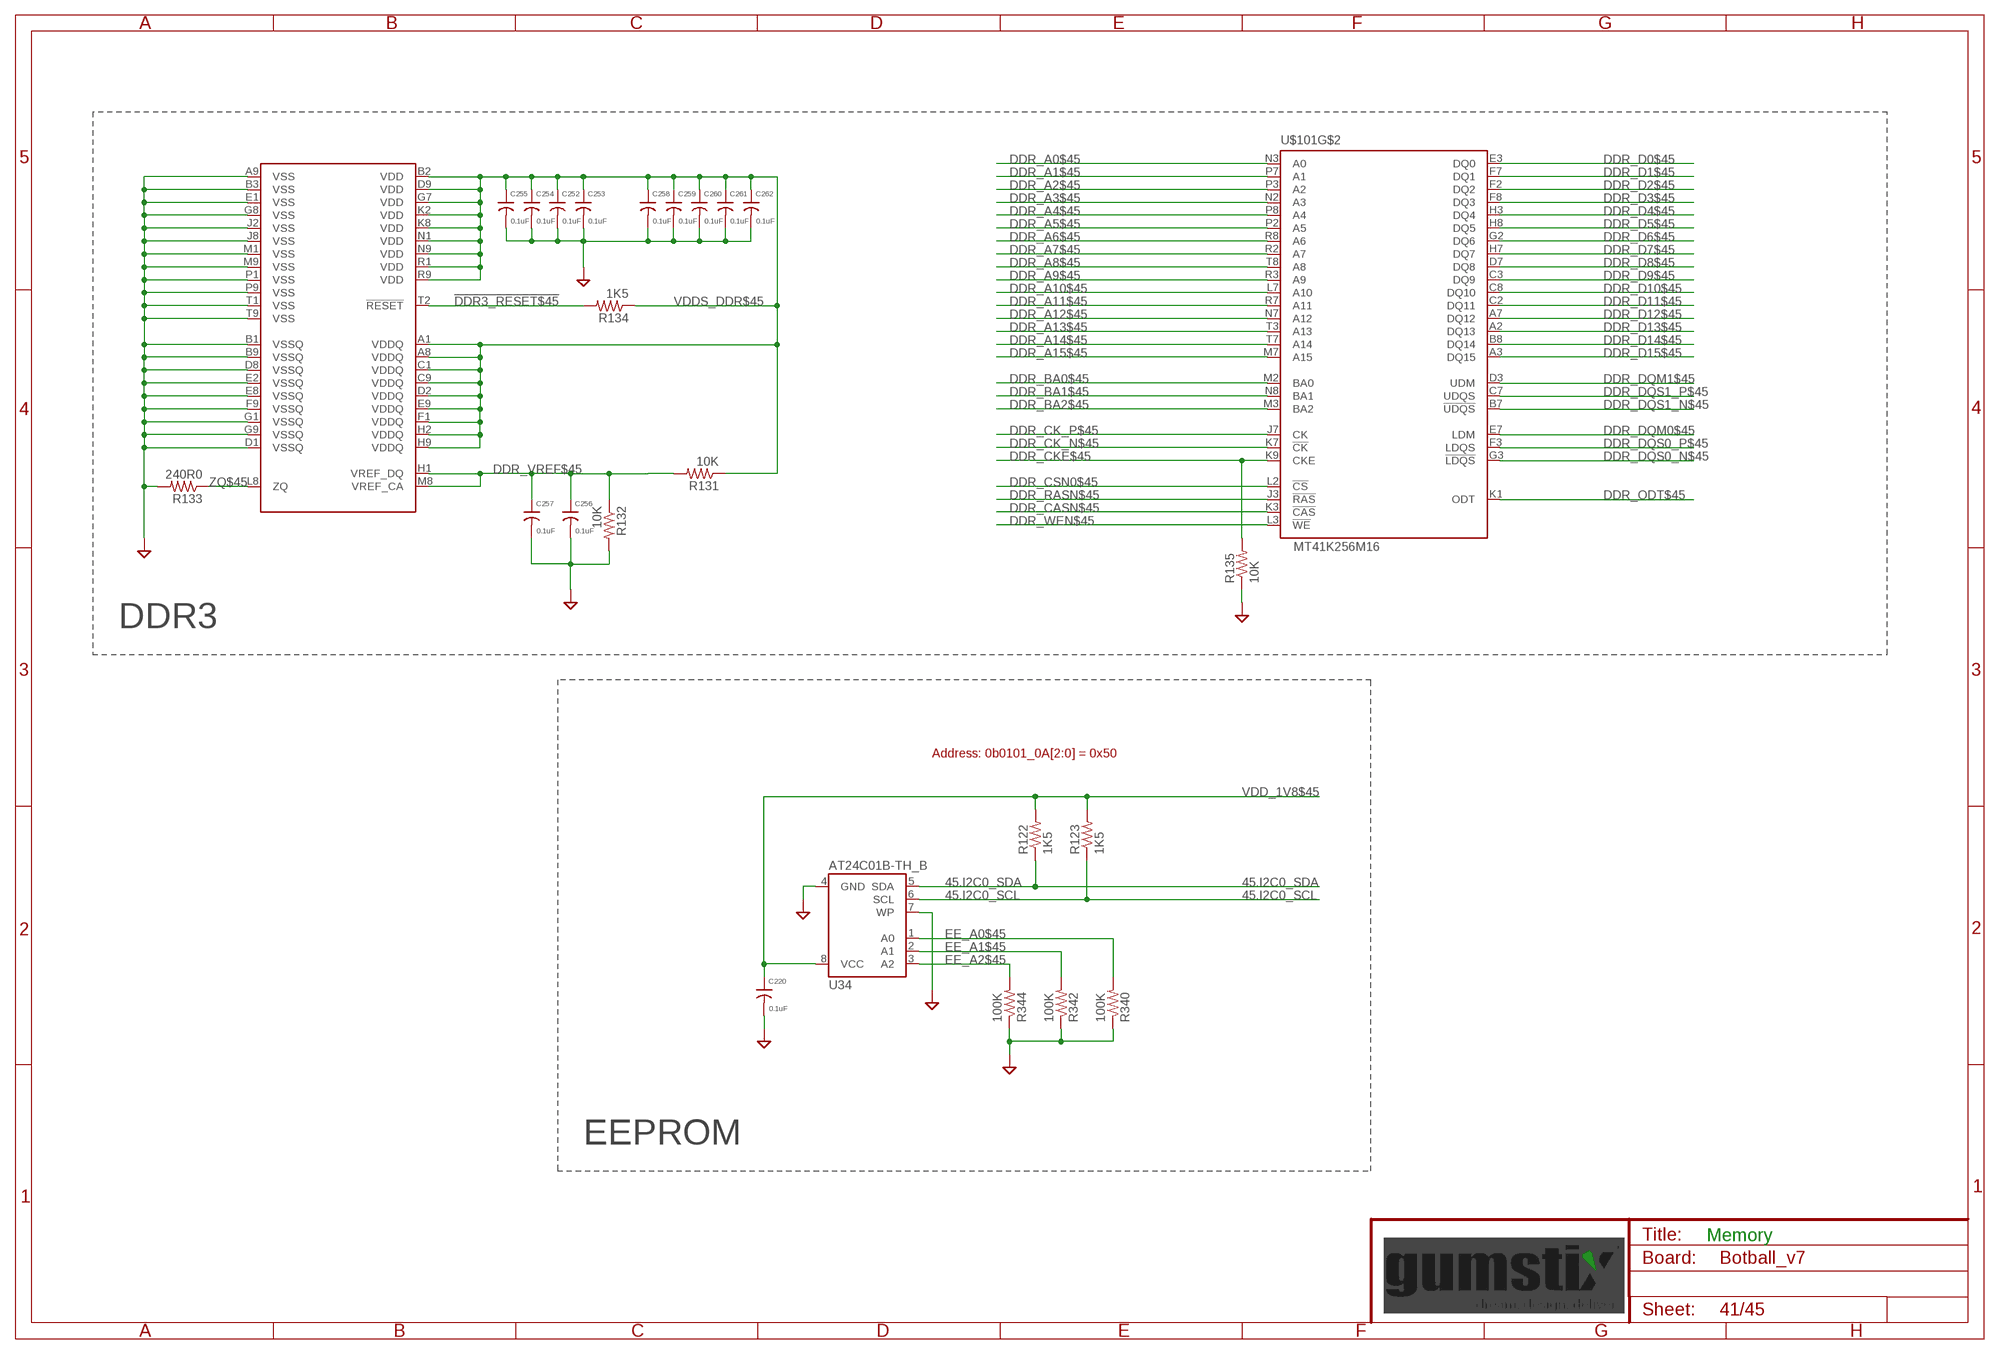
[diagram p40: schematic, sheet 41]

### Parts
C220  0.1uF  C0201  [0201]
C252  0.1uF  C0201  [0201]
C253  0.1uF  C0201  [0201]
C254  0.1uF  C0201  [0201]
C255  0.1uF  C0201  [0201]
C256  0.1uF  C0201  [0201]
C257  0.1uF  C0201  [0201]
C258  0.1uF  C0201  [0201]
C259  0.1uF  C0201  [0201]
C260  0.1uF  C0201  [0201]
C261  0.1uF  C0201  [0201]
C262  0.1uF  C0201  [0201]
R122  1K5  R0201  [0201]
R123  1K5  R0201  [0201]
R131  10K  R0201  [0201]
R132  10K  R0201  [0201]
R133  240R0  R0201  [0201]
R134  1K5  R0201  [0201]
R135  10K  R0201  [0201]
R340  100K  R0201  [0201]
R342  100K  R0201  [0201]
R344  100K  R0201  [0201]
U34  AT24C01B-TH_B  AT24CA  [TSSOP8]
U$101  MT41K256M16  [FBGA_96_10_14]

### Nets
45.I2C0_SCL: R123.1 U34.6(SCL) ; also sheet 16,40,42
45.I2C0_SDA: R122.1 U34.5(SDA) ; also sheet 16,40,42
!DDR3_RESET$45: R134.2 U$101.T2(!RESET) ; also sheet 42
DDR_A0$45: U$101.N3(A0) ; also sheet 42
DDR_A1$45: U$101.P7(A1) ; also sheet 42
DDR_A2$45: U$101.P3(A2) ; also sheet 42
DDR_A3$45: U$101.N2(A3) ; also sheet 42
DDR_A4$45: U$101.P8(A4) ; also sheet 42
DDR_A5$45: U$101.P2(A5) ; also sheet 42
DDR_A6$45: U$101.R8(A6) ; also sheet 42
DDR_A7$45: U$101.R2(A7) ; also sheet 42
DDR_A8$45: U$101.T8(A8) ; also sheet 42
DDR_A9$45: U$101.R3(A9) ; also sheet 42
DDR_A10$45: U$101.L7(A10) ; also sheet 42
DDR_A11$45: U$101.R7(A11) ; also sheet 42
DDR_A12$45: U$101.N7(A12) ; also sheet 42
DDR_A13$45: U$101.T3(A13) ; also sheet 42
DDR_A14$45: U$101.T7(A14) ; also sheet 42
DDR_A15$45: U$101.M7(A15) ; also sheet 42
DDR_BA0$45: U$101.M2(BA0) ; also sheet 42
DDR_BA1$45: U$101.N8(BA1) ; also sheet 42
DDR_BA2$45: U$101.M3(BA2) ; also sheet 42
DDR_CASN$45: U$101.K3(!CAS) ; also sheet 42
DDR_CK_N$45: U$101.K7(!CK) ; also sheet 42
DDR_CK_P$45: U$101.J7(CK) ; also sheet 42
DDR_CKE$45: R135.2 U$101.K9(CKE) ; also sheet 42
DDR_CSN0$45: U$101.L2(!CS) ; also sheet 42
DDR_D0$45: U$101.E3(DQ0) ; also sheet 42
DDR_D1$45: U$101.F7(DQ1) ; also sheet 42
DDR_D2$45: U$101.F2(DQ2) ; also sheet 42
DDR_D3$45: U$101.F8(DQ3) ; also sheet 42
DDR_D4$45: U$101.H3(DQ4) ; also sheet 42
DDR_D5$45: U$101.H8(DQ5) ; also sheet 42
DDR_D6$45: U$101.G2(DQ6) ; also sheet 42
DDR_D7$45: U$101.H7(DQ7) ; also sheet 42
DDR_D8$45: U$101.D7(DQ8) ; also sheet 42
DDR_D9$45: U$101.C3(DQ9) ; also sheet 42
DDR_D10$45: U$101.C8(DQ10) ; also sheet 42
DDR_D11$45: U$101.C2(DQ11) ; also sheet 42
DDR_D12$45: U$101.A7(DQ12) ; also sheet 42
DDR_D13$45: U$101.A2(DQ13) ; also sheet 42
DDR_D14$45: U$101.B8(DQ14) ; also sheet 42
DDR_D15$45: U$101.A3(DQ15) ; also sheet 42
DDR_DQM0$45: U$101.E7(LDM) ; also sheet 42
DDR_DQM1$45: U$101.D3(UDM) ; also sheet 42
DDR_DQS0_N$45: U$101.G3(!LDQS) ; also sheet 42
DDR_DQS0_P$45: U$101.F3(LDQS) ; also sheet 42
DDR_DQS1_N$45: U$101.B7(!UDQS) ; also sheet 42
DDR_DQS1_P$45: U$101.C7(UDQS) ; also sheet 42
DDR_ODT$45: U$101.K1(ODT) ; also sheet 42
DDR_RASN$45: U$101.J3(!RAS) ; also sheet 42
DDR_VREF$45: C256.1 C257.1 R131.2 R132.1 U$101.H1(VREF_DQ) U$101.M8(VREF_CA) ; also sheet 42
DDR_WEN$45: U$101.L3(!WE) ; also sheet 42
EE_A0$45: R340.2 U34.1(A0)
EE_A1$45: R342.2 U34.2(A1)
EE_A2$45: R344.2 U34.3(A2)
GND [supply]: C220.2 C252.2 C253.2 C254.2 C255.2 C256.2 C257.2 C258.2 C259.2 C260.2 C261.2 C262.2 R132.2 R133.2 R135.1 R340.1 R342.1 R344.1 U34.4(GND) U34.7(WP) U$101.A9(VSS) U$101.B1(VSSQ) U$101.B3(VSS) U$101.B9(VSSQ) U$101.D1(VSSQ) U$101.D8(VSSQ) U$101.E1(VSS) U$101.E2(VSSQ) U$101.E8(VSSQ) U$101.F9(VSSQ) U$101.G1(VSSQ) U$101.G8(VSS) U$101.G9(VSSQ) U$101.J2(VSS) U$101.J8(VSS) U$101.M1(VSS) U$101.M9(VSS) U$101.P1(VSS) U$101.P9(VSS) U$101.T1(VSS) U$101.T9(VSS) ; also sheet 2,3,4,5,6,7,9,10,11,12,13,14,15,16,17,18,19,20,21,22,23,24,25,26,27,28,29,30,31,32,33,34,35,36,37,38,39,40,42,43,44,45
VDD_1V8$45 [supply]: C220.1 R122.2 R123.2 U34.8(VCC) ; also sheet 40,42,43,44
VDDS_DDR$45 [supply]: C252.1 C253.1 C254.1 C255.1 C258.1 C259.1 C260.1 C261.1 C262.1 R131.1 R134.1 U$101.A1(VDDQ) U$101.A8(VDDQ) U$101.B2(VDD) U$101.C1(VDDQ) U$101.C9(VDDQ) U$101.D2(VDDQ) U$101.D9(VDD) U$101.E9(VDDQ) U$101.F1(VDDQ) U$101.G7(VDD) U$101.H2(VDDQ) U$101.H9(VDDQ) U$101.K2(VDD) U$101.K8(VDD) U$101.N1(VDD) U$101.N9(VDD) U$101.R1(VDD) U$101.R9(VDD) ; also sheet 40,44
ZQ$45: R133.1 U$101.L8(ZQ)

### Notes on the sheet
- DDR3
- Address: 0b0101_0A[2:0] = 0x50
- EEPROM
- Memory